# EAGLE design firecam (EAGLE 7.7.0)

## Sheet 1 of 4
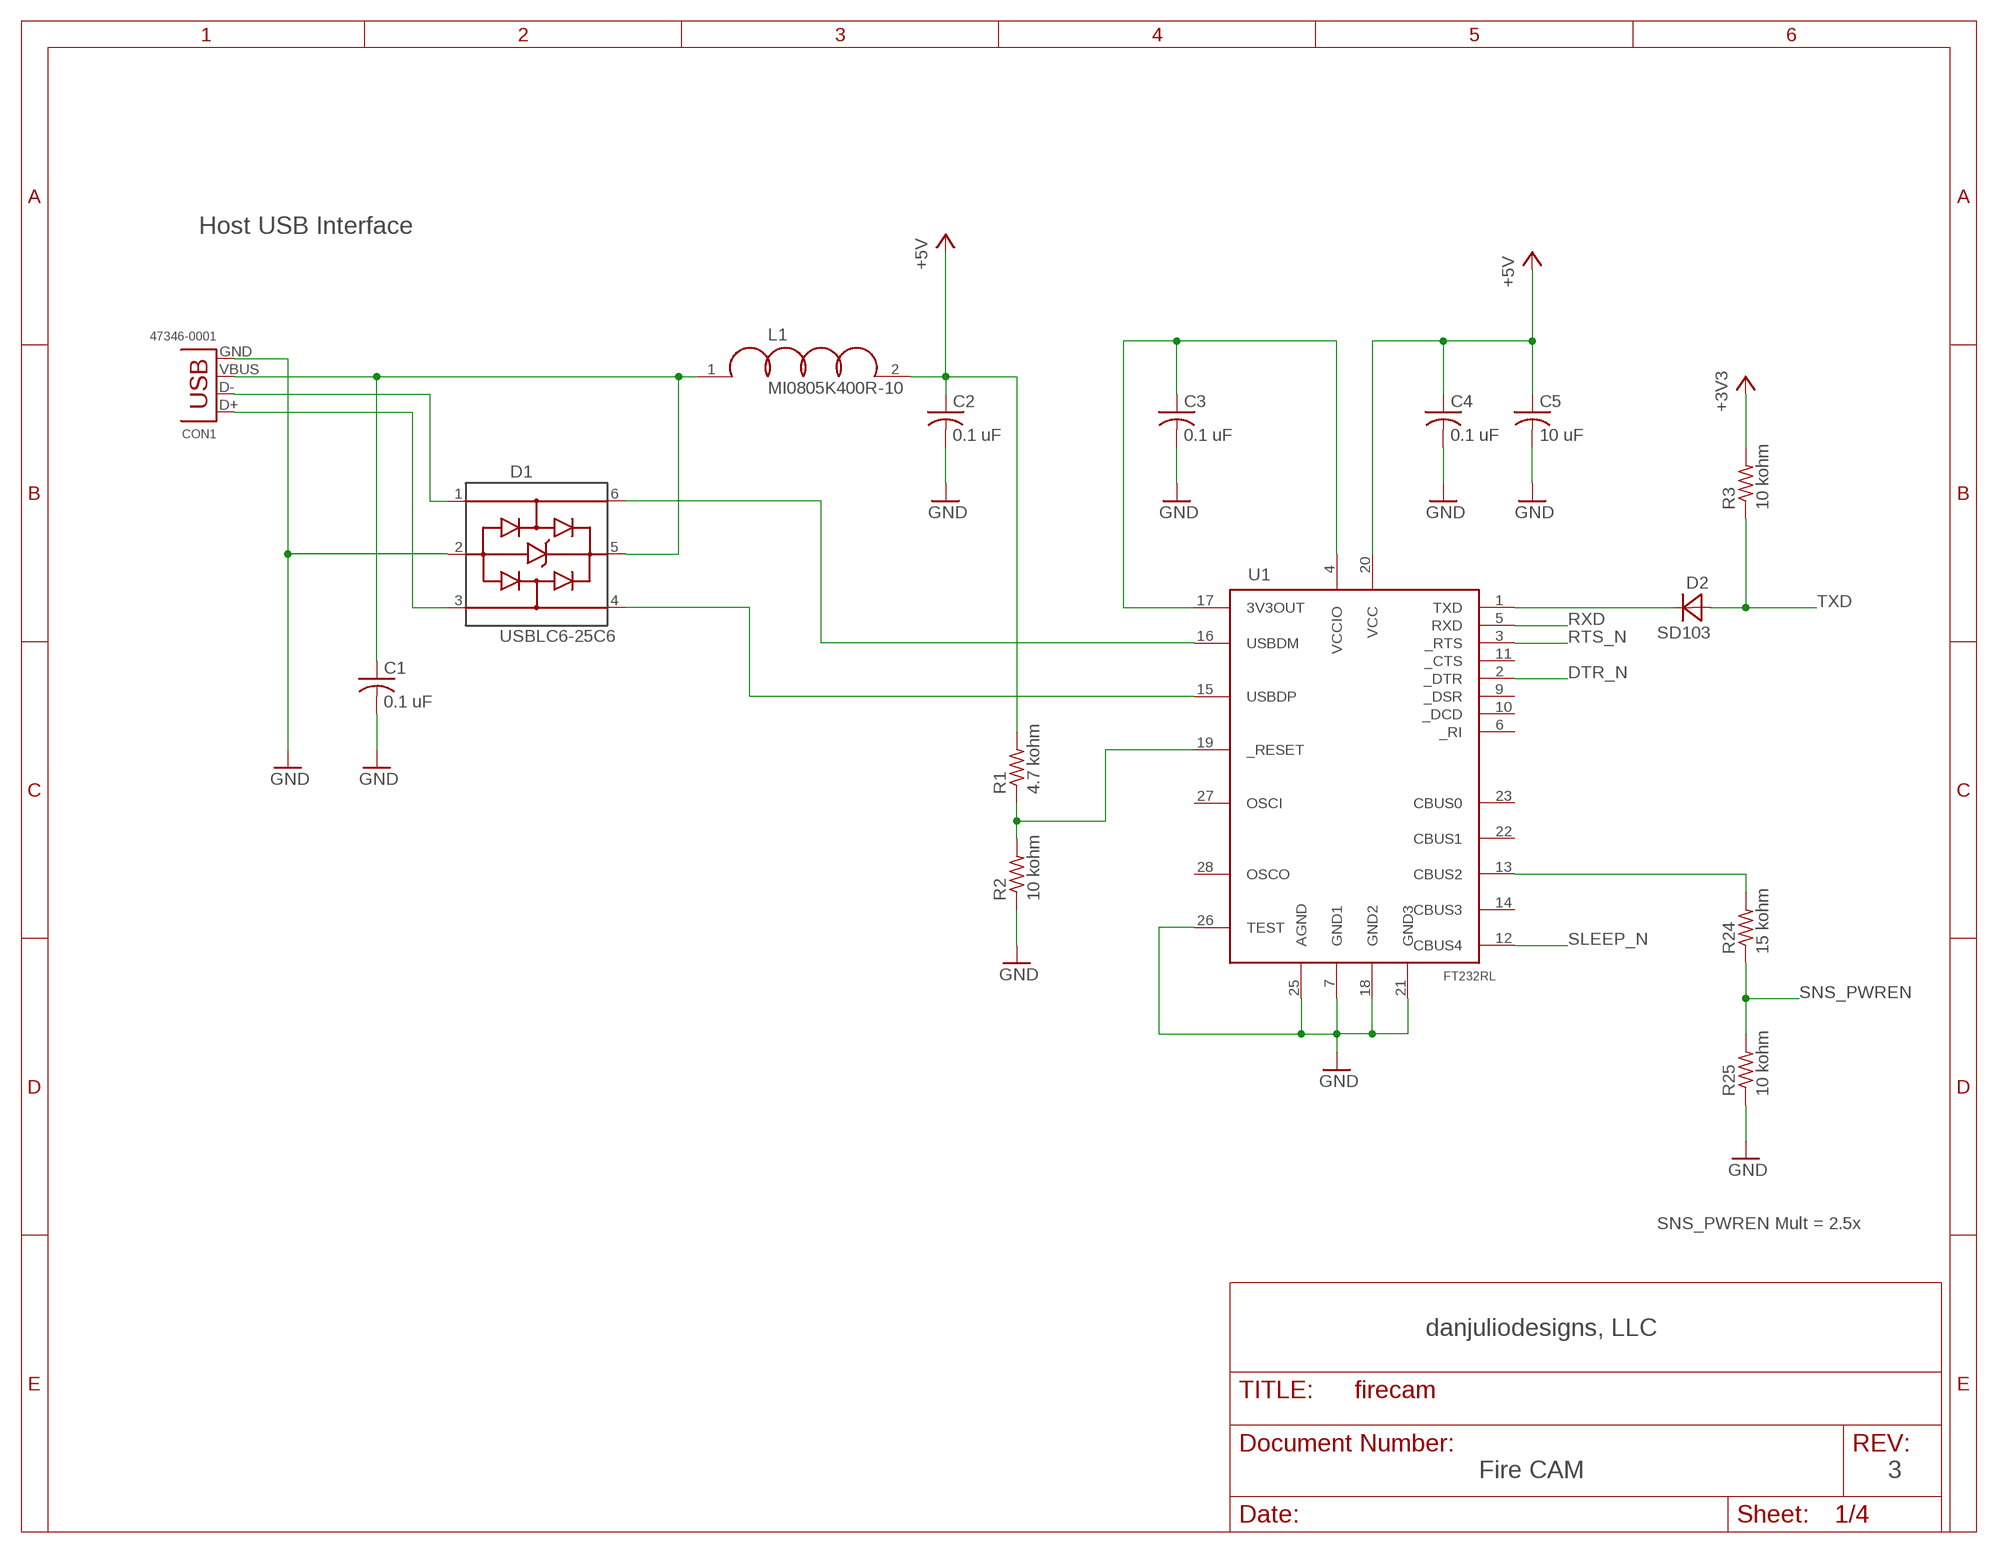
[diagram p0: schematic, sheet 1]

### Parts
C1  0.1 uF  C-USSMT0603  [C0603]
C2  0.1 uF  C-USSMT0603  [C0603]
C3  0.1 uF  C-USSMT0603  [C0603]
C4  0.1 uF  C-USSMT0603  [C0603]
C5  10 uF  C-USSMT0603  [C0603]
CON1  47346-0001  USBMICROB  [USB_MICROB_SMT]
D1  USBLC6-25C6  USBLC6-2SOT23-6  [SOT23-6]
D2  SD103  DIODESMT_SOD123  [SOD123]
L1  MI0805K400R-10  INDUCTORSMT0805  [L0805]
R1  4.7 kohm  R-USSMT0603  [R0603]
R2  10 kohm  R-USSMT0603  [R0603]
R3  10 kohm  R-USSMT0603  [R0603]
R24  15 kohm  R-USSMT0603  [R0603]
R25  10 kohm  R-USSMT0603  [R0603]
U1  FT232RL  FT232RLSSOP28  [SSOP28DB]

### Nets
+3V3: R3.2 ; also sheet 2,3,4
+5V: C2.1 C4.1 C5.1 L1.2 R1.2 U1.20(VCC) ; also sheet 2
DTR_N: U1.2(_DTR) ; also sheet 3
GND: C1.2 C2.2 C3.2 C4.2 C5.2 CON1.GND D1.2(GND) R2.1 R25.1 U1.7(GND1) U1.18(GND2) U1.21(GND3) U1.25(AGND) U1.26(TEST) ; also sheet 2,3,4
N$1: C1.1 CON1.VBUS D1.5(VBUS) L1.1
N$2: CON1.D+ D1.3(IO2)
N$3: CON1.D- D1.1(IO1)
N$4: C3.1 U1.4(VCCIO) U1.17(3V3OUT)
N$5: D2.C U1.1(TXD)
N$6: D1.6(IO1$1) U1.16(USBDM)
N$7: D1.4(IO2$1) U1.15(USBDP)
N$12: R1.1 R2.2 U1.19(_RESET)
N$25: R24.2 U1.13(CBUS2)
RTS_N: U1.3(_RTS) ; also sheet 3
RXD: U1.5(RXD) ; also sheet 3
SLEEP_N: U1.12(CBUS4) ; also sheet 2
SNS_PWREN: R24.1 R25.2 ; also sheet 3
TXD: D2.A R3.1 ; also sheet 3
Unconnected: U1.6(_RI) U1.9(_DSR) U1.10(_DCD) U1.11(_CTS) U1.14(CBUS3) U1.22(CBUS1) U1.23(CBUS0) U1.27(OSCI) U1.28(OSCO)

### Notes on the sheet
- Host USB Interface
- SNS_PWREN Mult = 2.5x
- danjuliodesigns, LLC
- Fire CAM | 3

## Sheet 2 of 4
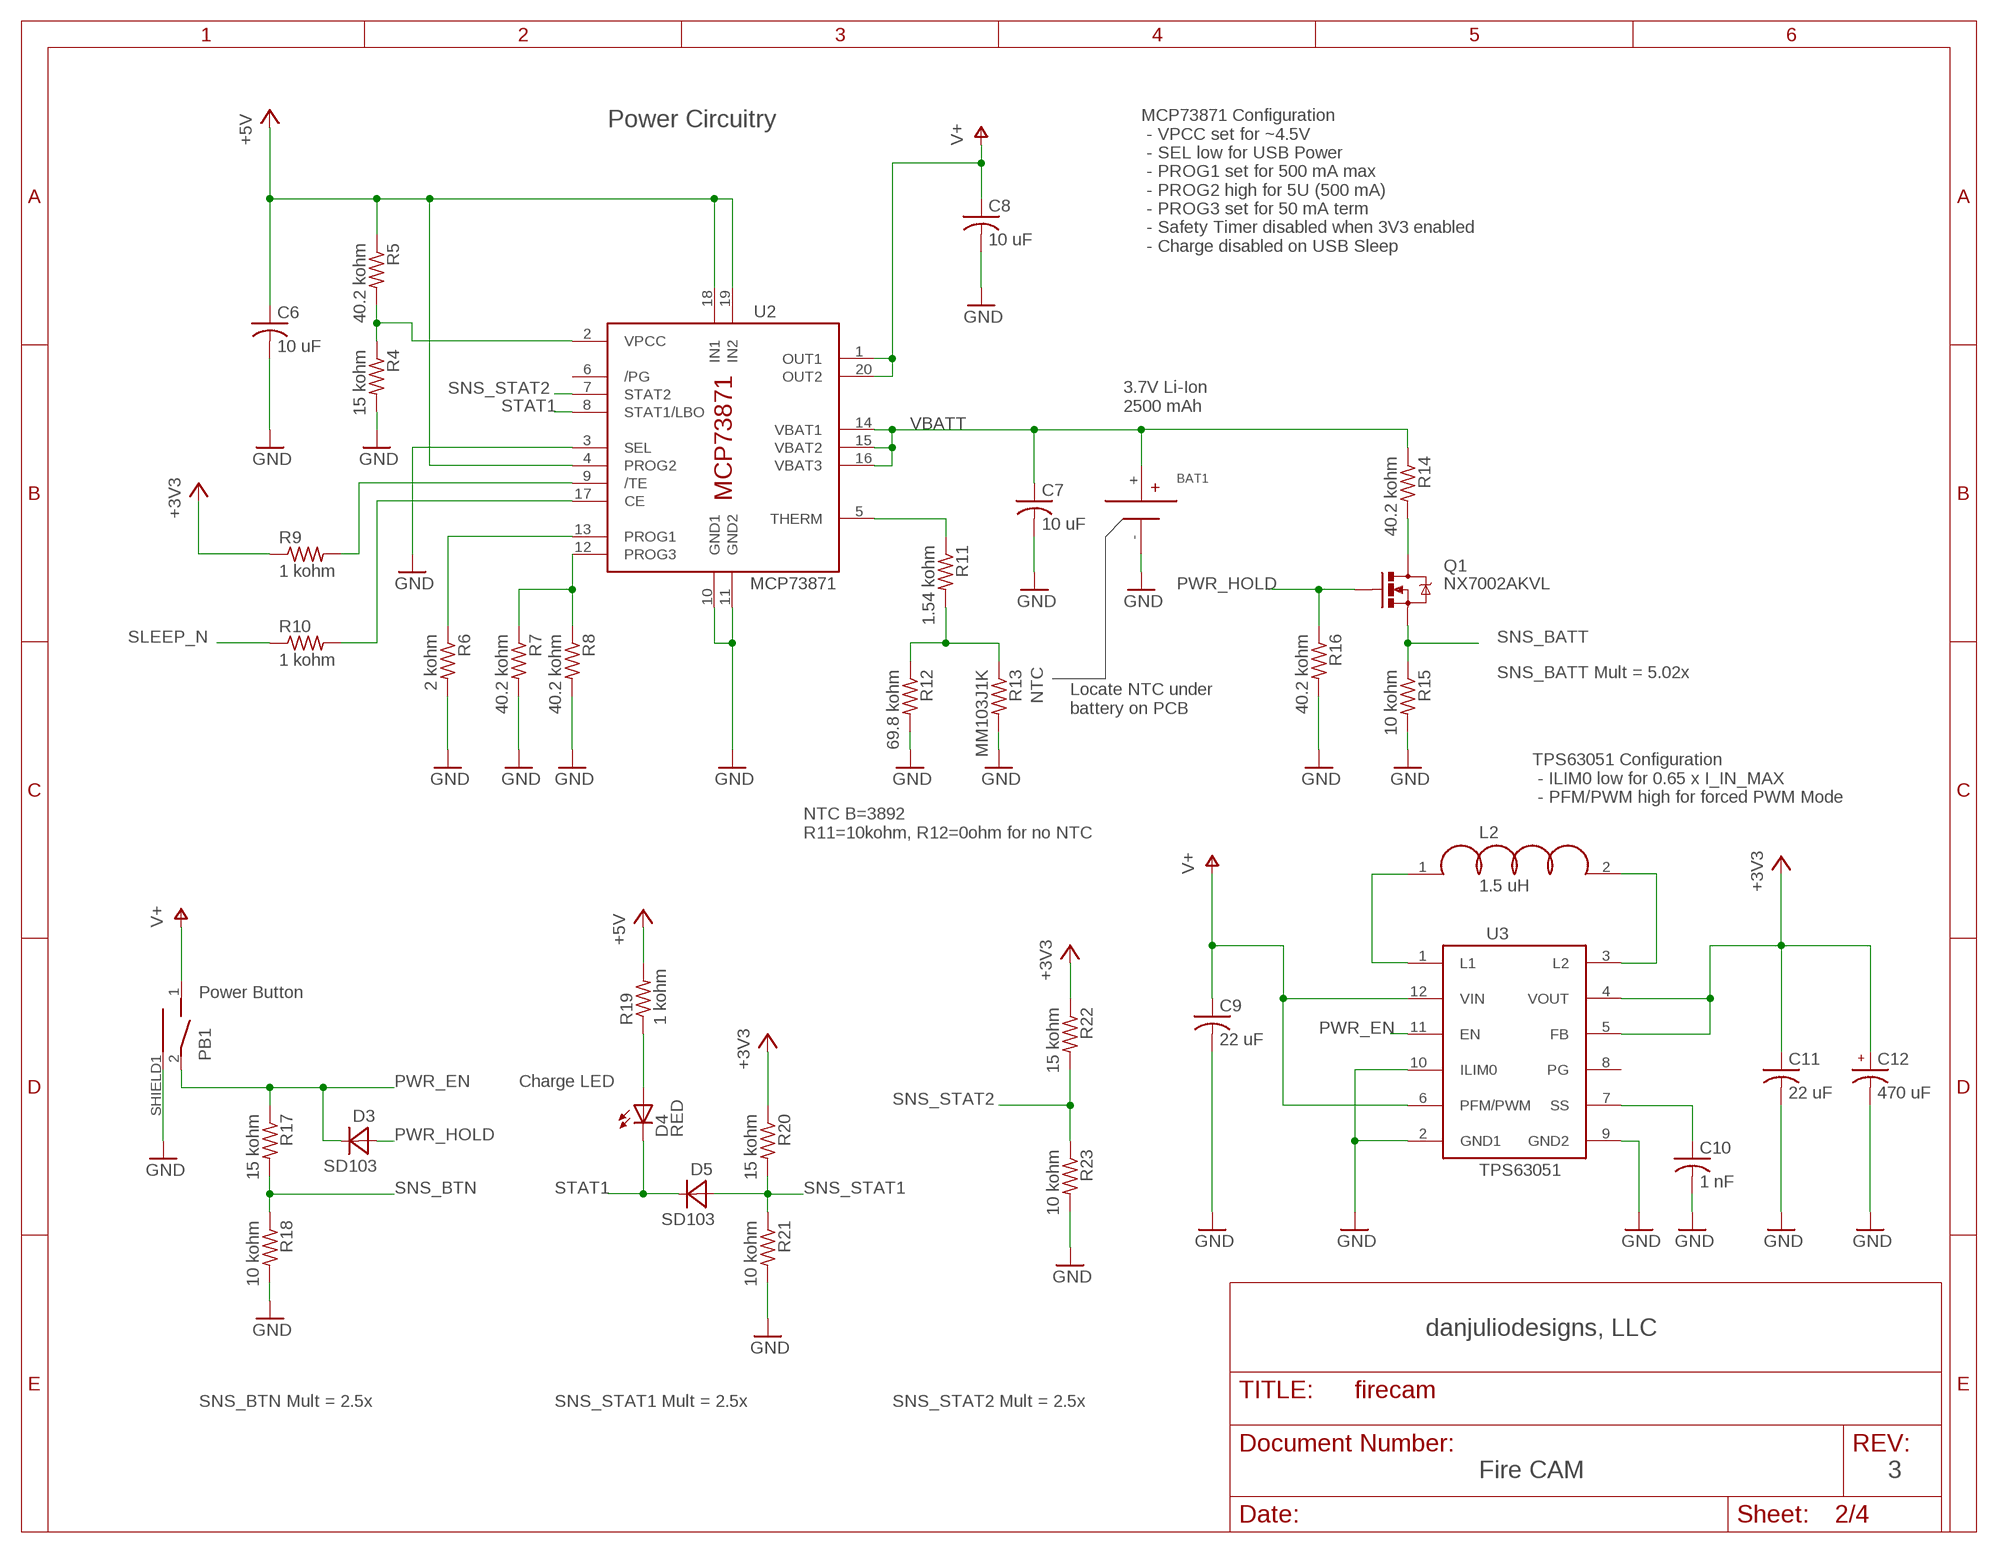
[diagram p1: schematic, sheet 2]

### Parts
BAT1  18650_BATTERYTH  [KEYSTONE_1043]
C6  10 uF  C-USSMT0603  [C0603]
C7  10 uF  C-USSMT0603  [C0603]
C8  10 uF  C-USSMT0603  [C0603]
C9  22 uF  C-USSMT0603  [C0603]
C10  1 nF  C-USSMT0603  [C0603]
C11  22 uF  C-USSMT0603  [C0603]
C12  470 uF  CPOL-USSMT06X06  [ECAP-0606]
D3  SD103  DIODESMT_SOD123  [SOD123]
D4  RED  LEDLUMEX_SMT_3MM  [LUMEX_3MM_SMT]
D5  SD103  DIODESMT_SOD123  [SOD123]
L2  1.5 uH  INDUCTORSMT1008  [L1008]
PB1  PB_SMT_SIDEPTS645  [PTS645_SIDE_TH]
Q1  NX7002AKVL  MOSFET-NCHANNELSOT23  [SOT23-3]
R4  15 kohm  R-USSMT0603  [R0603]
R5  40.2 kohm  R-USSMT0603  [R0603]
R6  2 kohm  R-USSMT0603  [R0603]
R7  40.2 kohm  R-USSMT0603  [R0603]
R8  40.2 kohm  R-USSMT0603  [R0603]
R9  1 kohm  R-USSMT0603  [R0603]
R10  1 kohm  R-USSMT0603  [R0603]
R11  1.54 kohm  R-USSMT0603  [R0603]
R12  69.8 kohm  R-USSMT0603  [R0603]
R13  MM103J1K  R-USSMT0603  [R0603]
R14  40.2 kohm  R-USSMT0603  [R0603]
R15  10 kohm  R-USSMT0603  [R0603]
R16  40.2 kohm  R-USSMT0603  [R0603]
R17  15 kohm  R-USSMT0603  [R0603]
R18  10 kohm  R-USSMT0603  [R0603]
R19  1 kohm  R-USSMT0603  [R0603]
R20  15 kohm  R-USSMT0603  [R0603]
R21  10 kohm  R-USSMT0603  [R0603]
R22  15 kohm  R-USSMT0603  [R0603]
R23  10 kohm  R-USSMT0603  [R0603]
U2  MCP73871  [QFN20]
U3  TPS63051  TPS63051_QFN  [HOTROD_QFN12]

### Nets
+3V3: C11.1 C12.+ R9.1 R20.1 R22.1 U3.4(VOUT) U3.5(FB) ; also sheet 1,3,4
+5V: C6.1 R5.1 R19.2 U2.4(PROG2) U2.18(IN1) U2.19(IN2) ; also sheet 1
GND: BAT1.- C6.2 C7.2 C8.2 C9.2 C10.2 C11.2 C12.- PB1.SHIELD1(CASE) R4.2 R6.2 R7.2 R8.2 R12.2 R13.2 R15.2 R16.2 R18.2 R21.2 R23.2 U2.3(SEL) U2.10(GND1) U2.11(GND2) U3.2(GND1) U3.9(GND2) U3.10(ILIM0) ; also sheet 1,3,4
N$9: R4.1 R5.2 U2.2(VPCC)
N$10: R6.1 U2.13(PROG1)
N$15: R7.1 R8.1 U2.12(PROG3)
N$18: R9.2 U2.9(/TE)
N$19: R10.2 U2.17(CE)
N$20: R11.1 U2.5(THERM)
N$21: L2.1 U3.1(L1)
N$22: Q1.3(D) R14.2
N$23: D4.P$1(A) R19.1
N$28: R11.2 R12.1 R13.1
N$29: L2.2 U3.3(L2)
N$32: C10.1 U3.7(SS)
PWR_EN: D3.C PB1.2 R17.1 U3.11(EN) ; also sheet 4
PWR_HOLD: D3.A Q1.1(G) R16.1 ; also sheet 3,4
SLEEP_N: R10.1 ; also sheet 1
SNS_BATT: Q1.2(S) R15.1 ; also sheet 3
SNS_BTN: R17.2 R18.1 ; also sheet 3
SNS_STAT1: D5.A R20.2 R21.1 ; also sheet 3
SNS_STAT2: R22.2 R23.1 U2.7(STAT2) ; also sheet 3
STAT1: D4.P$2(C) D5.C U2.8(STAT1/LBO)
V+: C8.1 C9.1 PB1.1 U2.1(OUT1) U2.20(OUT2) U3.6(PFM/PWM) U3.12(VIN) ; also sheet 4
VBATT: BAT1.+ C7.1 R14.1 U2.14(VBAT1) U2.15(VBAT2) U2.16(VBAT3)
Unconnected: U2.6(/PG) U3.8(PG)

### Notes on the sheet
- Power Circuitry
- MCP73871 Configuration
   - VPCC set for ~4.5V
   - SEL low for USB Power
   - PROG1 set for 500 mA max
   - PROG2 high for 5U (500 mA)
   - PROG3 set for 50 mA term
   - Safety Timer disabled when 3V3 enabled
   - Charge disabled on USB Sleep
- 3.7V Li-Ion
  2500 mAh
- SNS_BATT Mult = 5.02x
- NTC
- Locate NTC under
  battery on PCB
- TPS63051 Configuration
   - ILIM0 low for 0.65 x I_IN_MAX
   - PFM/PWM high for forced PWM Mode
- NTC B=3892
  R11=10kohm, R12=0ohm for no NTC
- Power Button
- Charge LED
- danjuliodesigns, LLC
- SNS_BTN Mult = 2.5x | SNS_STAT1 Mult = 2.5x | SNS_STAT2 Mult = 2.5x
- Fire CAM | 3

## Sheet 3 of 4
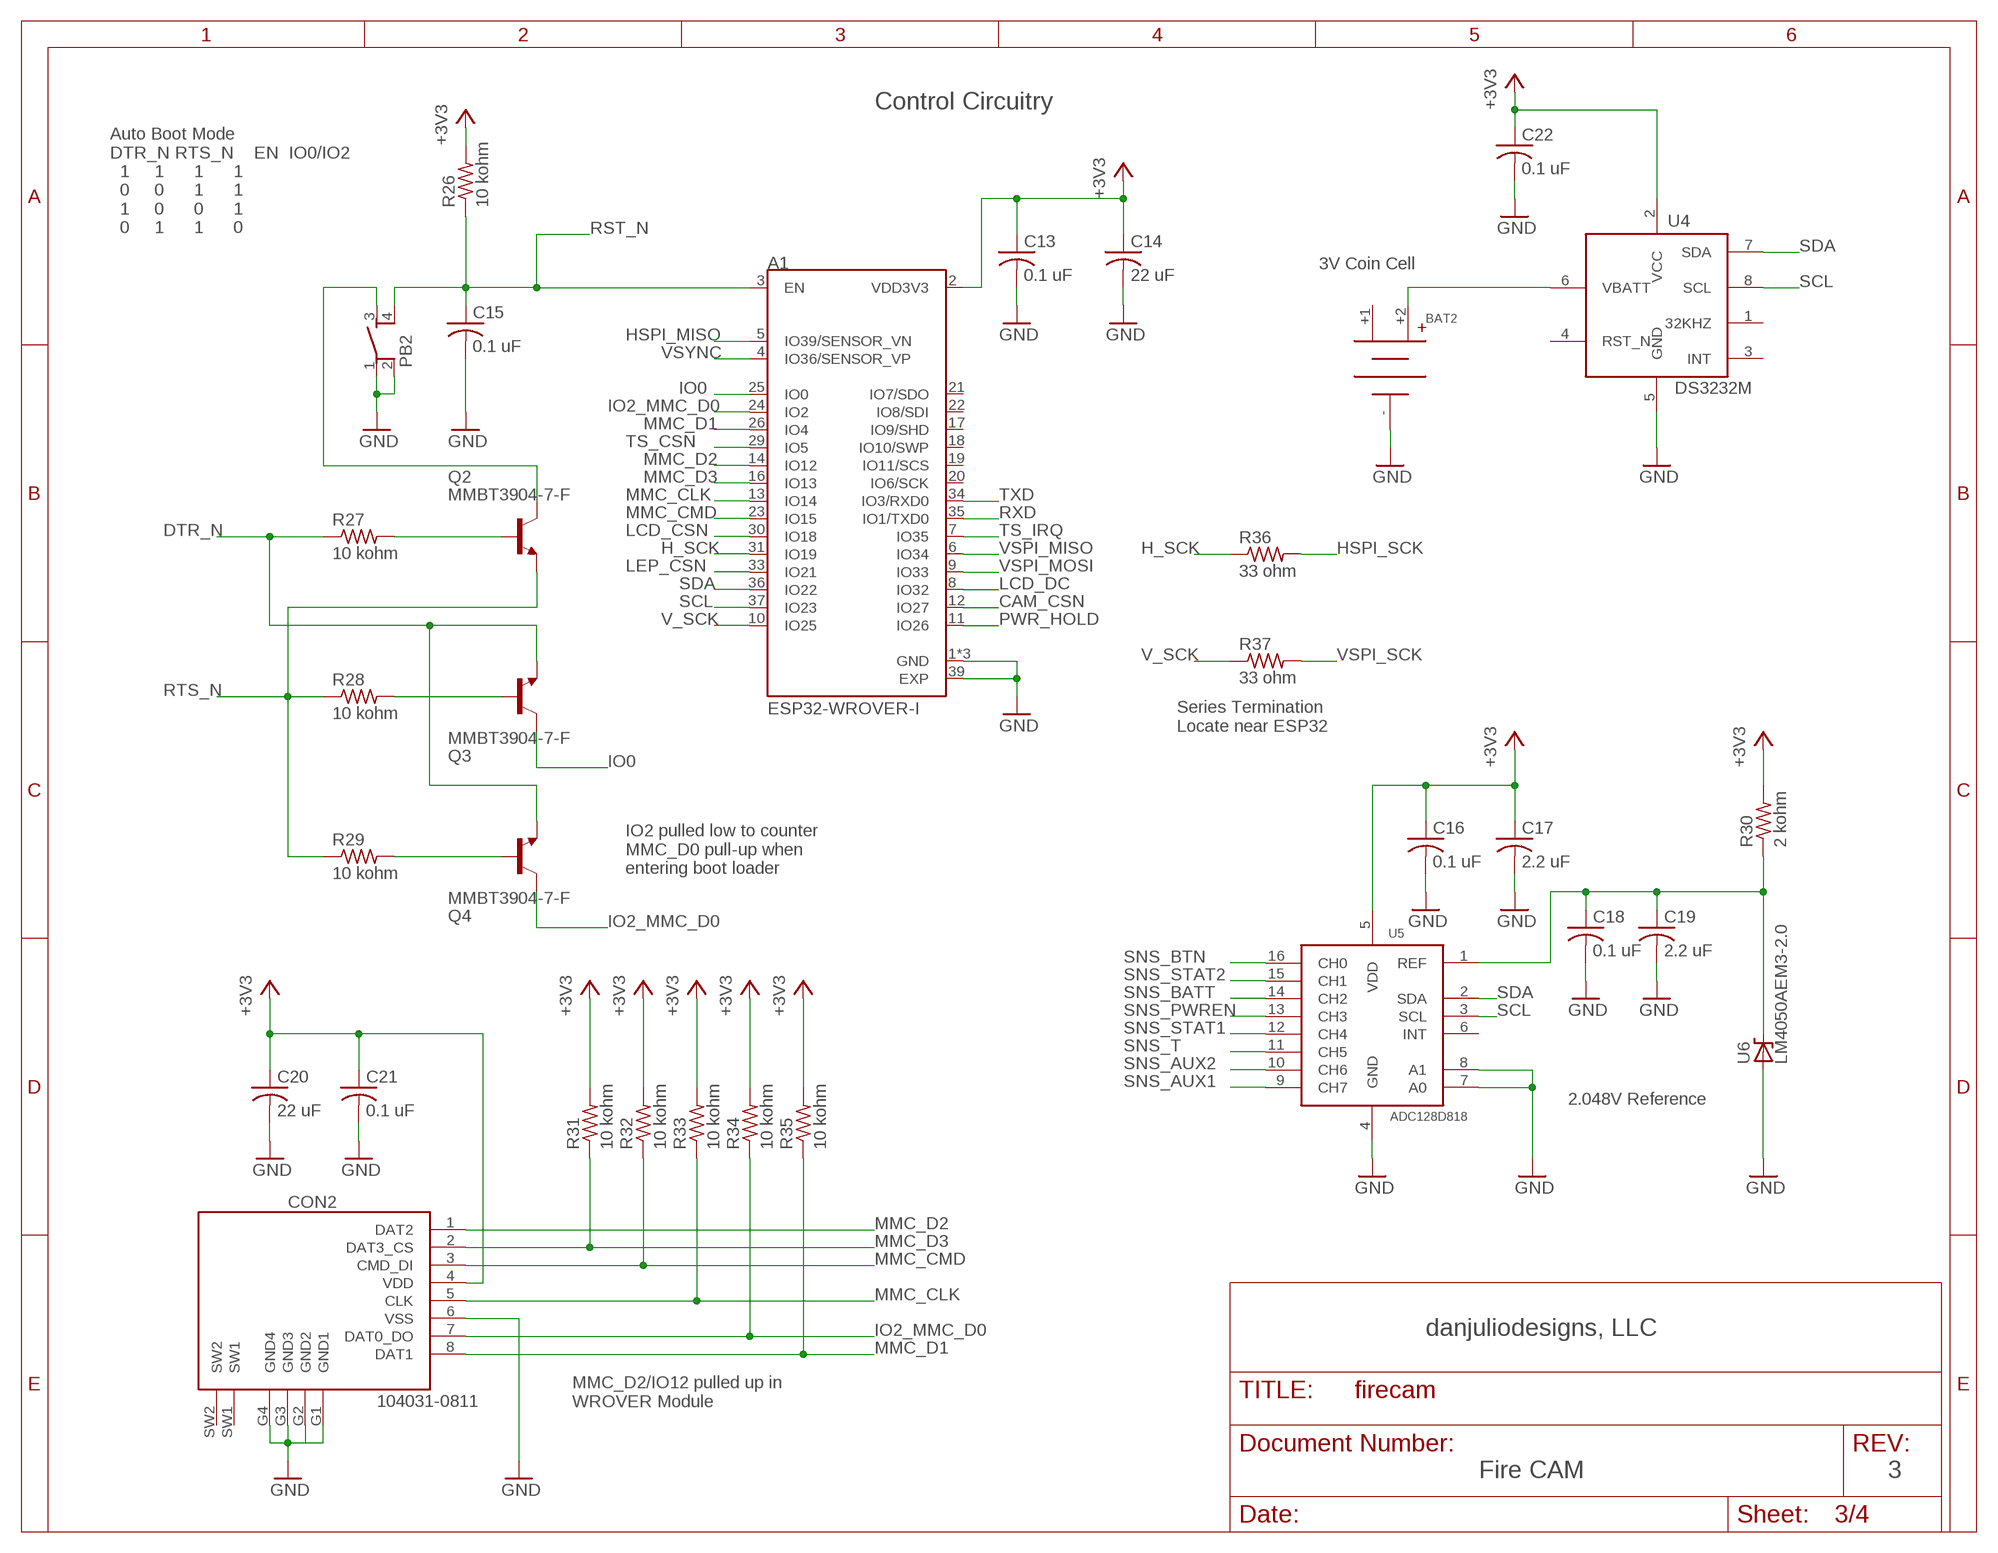
[diagram p2: schematic, sheet 3]

### Parts
A1  ESP32-WROVER-I  [XCVR_ESP32-WROVER-I]
BAT2  COIN_CELL12MM  [KEYSTONE_3001]
C13  0.1 uF  C-USSMT0603  [C0603]
C14  22 uF  C-USSMT0603  [C0603]
C15  0.1 uF  C-USSMT0603  [C0603]
C16  0.1 uF  C-USSMT0603  [C0603]
C17  2.2 uF  C-USSMT0603  [C0603]
C18  0.1 uF  C-USSMT0603  [C0603]
C19  2.2 uF  C-USSMT0603  [C0603]
C20  22 uF  C-USSMT0603  [C0603]
C21  0.1 uF  C-USSMT0603  [C0603]
C22  0.1 uF  C-USSMT0603  [C0603]
CON2  104031-0811  MOLEX_1040310811  [MOLEX_1040310811]
PB2  PB_TACT_4SMTR92  [CK_PTS645_SMT]
Q2  MMBT3904-7-F  BC808-NPN-SOT23-BEC  [SOT23-BEC]
Q3  MMBT3904-7-F  BC808-NPN-SOT23-BEC  [SOT23-BEC]
Q4  MMBT3904-7-F  BC808-NPN-SOT23-BEC  [SOT23-BEC]
R26  10 kohm  R-USSMT0603  [R0603]
R27  10 kohm  R-USSMT0603  [R0603]
R28  10 kohm  R-USSMT0603  [R0603]
R29  10 kohm  R-USSMT0603  [R0603]
R30  2 kohm  R-USSMT0603  [R0603]
R31  10 kohm  R-USSMT0603  [R0603]
R32  10 kohm  R-USSMT0603  [R0603]
R33  10 kohm  R-USSMT0603  [R0603]
R34  10 kohm  R-USSMT0603  [R0603]
R35  10 kohm  R-USSMT0603  [R0603]
R36  33 ohm  R-USSMT0603  [R0603]
R37  33 ohm  R-USSMT0603  [R0603]
U4  DS3232M  [SO8]
U5  ADC128D818  [SSOP16]
U6  LM4050AEM3-2.0  VOLTAGE_REFSMT_SOT23  [SOT23-3]

### Nets
+3V3: A1.2(VDD3V3) C13.1 C14.1 C16.1 C17.1 C20.1 C21.1 C22.1 CON2.4(VDD) R26.2 R30.2 R31.2 R32.2 R33.2 R34.2 R35.2 U4.2(VCC) U5.5(VDD) ; also sheet 1,2,4
CAM_CSN: A1.12(IO27) ; also sheet 4
DTR_N: Q3.E Q4.E R27.1 ; also sheet 1
GND: A1.1(GND) A1.15(GND) A1.38(GND) A1.39(EXP) BAT2.- C13.2 C14.2 C15.2 C16.2 C17.2 C18.2 C19.2 C20.2 C21.2 C22.2 CON2.6(VSS) CON2.G1(GND1) CON2.G2(GND2) CON2.G3(GND3) CON2.G4(GND4) PB2.1 PB2.2 U4.5(GND) U5.4(GND) U5.7(A0) U5.8(A1) U6.2(A) ; also sheet 1,2,4
H_SCK: A1.31(IO19) R36.1
HSPI_MISO: A1.5(IO39/SENSOR_VN) ; also sheet 4
HSPI_SCK: R36.2 ; also sheet 4
IO0: A1.25(IO0) Q3.C
IO2_MMC_D0: A1.24(IO2) CON2.7(DAT0_DO) Q4.C R34.1
LCD_CSN: A1.30(IO18) ; also sheet 4
LCD_DC: A1.8(IO32) ; also sheet 4
LEP_CSN: A1.33(IO21) ; also sheet 4
MMC_CLK: A1.13(IO14) CON2.5(CLK) R33.1
MMC_CMD: A1.23(IO15) CON2.3(CMD_DI) R32.1
MMC_D1: A1.26(IO4) CON2.8(DAT1) R35.1
MMC_D2: A1.14(IO12) CON2.1(DAT2)
MMC_D3: A1.16(IO13) CON2.2(DAT3_CS) R31.1
N$8: C18.1 C19.1 R30.1 U5.1(REF) U6.1(C)
N$13: BAT2.+2 U4.6(VBATT)
N$14: PB2.3 Q2.C
N$24: Q2.B R27.2
N$26: Q3.B R28.2
N$27: Q4.B R29.2
PWR_HOLD: A1.11(IO26) ; also sheet 2,4
RST_N: A1.3(EN) C15.1 PB2.4 R26.1 ; also sheet 4
RTS_N: Q2.E R28.1 R29.1 ; also sheet 1
RXD: A1.35(IO1/TXD0) ; also sheet 1
SCL: A1.37(IO23) U4.8(SCL) U5.3(SCL) ; also sheet 4
SDA: A1.36(IO22) U4.7(SDA) U5.2(SDA) ; also sheet 4
SNS_AUX1: U5.9(CH7) ; also sheet 4
SNS_AUX2: U5.10(CH6) ; also sheet 4
SNS_BATT: U5.14(CH2) ; also sheet 2
SNS_BTN: U5.16(CH0) ; also sheet 2
SNS_PWREN: U5.13(CH3) ; also sheet 1
SNS_STAT1: U5.12(CH4) ; also sheet 2
SNS_STAT2: U5.15(CH1) ; also sheet 2
SNS_T: U5.11(CH5) ; also sheet 4
TS_CSN: A1.29(IO5) ; also sheet 4
TS_IRQ: A1.7(IO35) ; also sheet 4
TXD: A1.34(IO3/RXD0) ; also sheet 1
V_SCK: A1.10(IO25) R37.1
VSPI_MISO: A1.6(IO34) ; also sheet 4
VSPI_MOSI: A1.9(IO33) ; also sheet 4
VSPI_SCK: R37.2 ; also sheet 4
VSYNC: A1.4(IO36/SENSOR_VP) ; also sheet 4
Unconnected: A1.17(IO9/SHD) A1.18(IO10/SWP) A1.19(IO11/SCS) A1.20(IO6/SCK) A1.21(IO7/SDO) A1.22(IO8/SDI) CON2.SW1 CON2.SW2 U4.1(32KHZ) U4.3(INT) U4.4(RST_N) U5.6(INT)

### Notes on the sheet
- Control Circuitry
- Auto Boot Mode
  DTR_N RTS_N    EN  IO0/IO2
    1     1      1      1
    0     0      1      1
    1     0      0      1
    0     1      1      0
- 3V Coin Cell
- Series Termination
  Locate near ESP32
- IO2 pulled low to counter
  MMC_D0 pull-up when 
  entering boot loader
- 2.048V Reference
- danjuliodesigns, LLC
- MMC_D2/IO12 pulled up in
  WROVER Module
- Fire CAM | 3

## Sheet 4 of 4
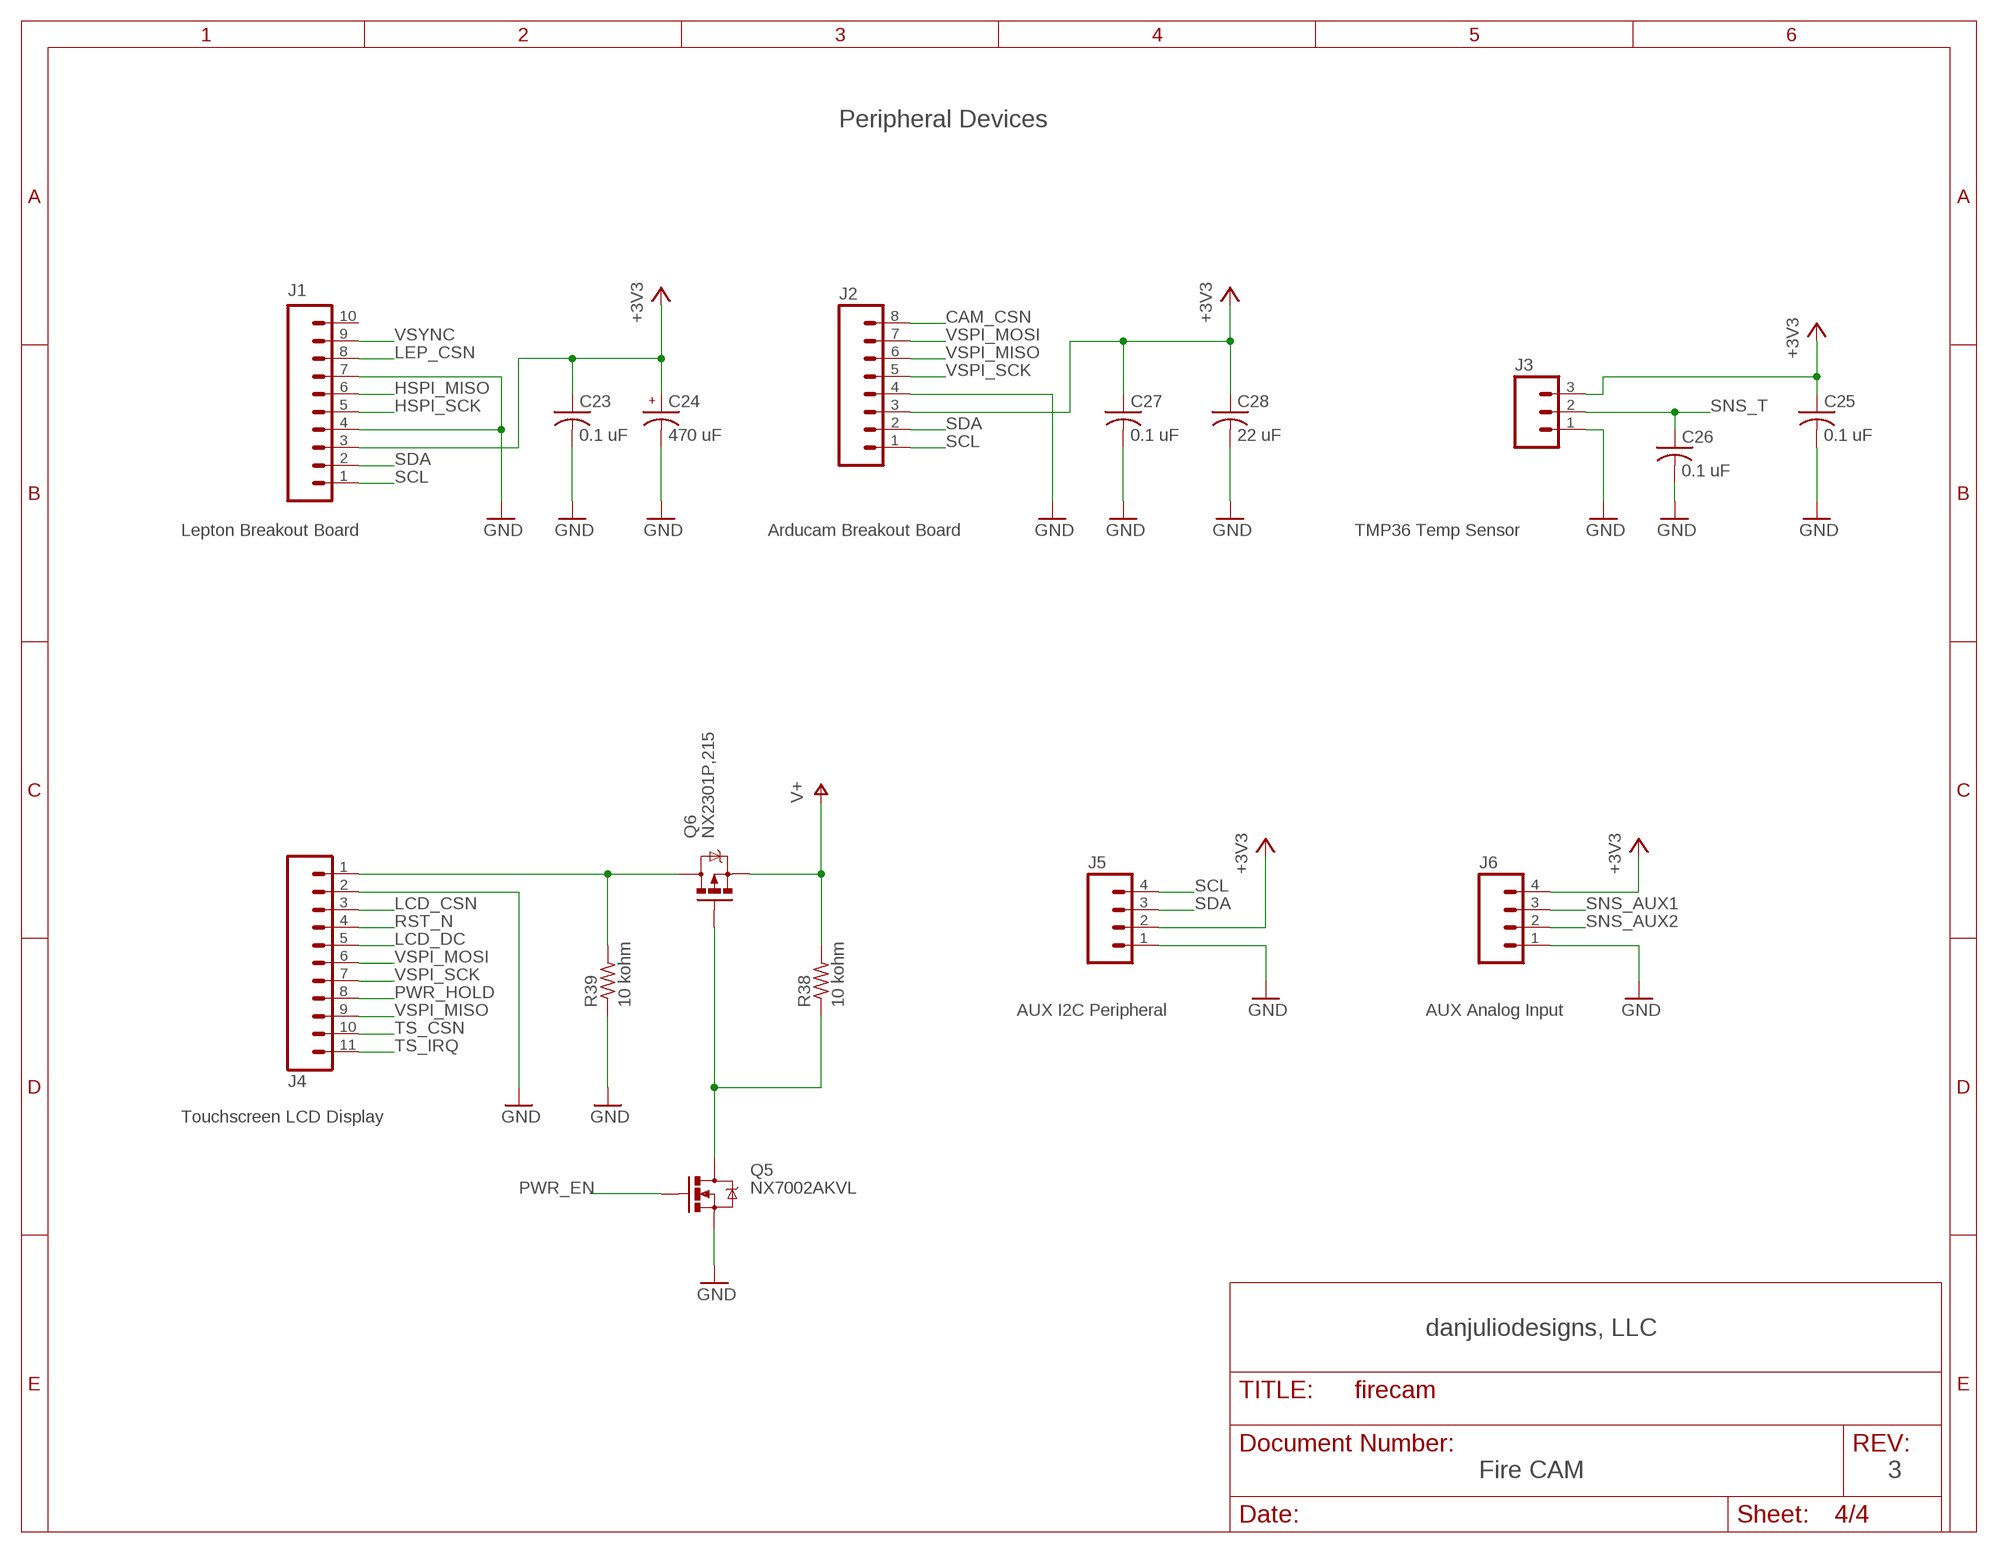
[diagram p3: schematic, sheet 4]

### Parts
C23  0.1 uF  C-USSMT0603  [C0603]
C24  470 uF  CPOL-USSMT06X06  [ECAP-0606]
C25  0.1 uF  C-USSMT0603  [C0603]
C26  0.1 uF  C-USSMT0603  [C0603]
C27  0.1 uF  C-USSMT0603  [C0603]
C28  22 uF  C-USSMT0603  [C0603]
J1  M10SILK_FEMALE_PTH  [1X10]
J2  M08SILK_FEMALE_PTH  [1X08]
J3  M03PTH  [1X03]
J4  M11PTH  [1X11]
J5  M04PTH  [1X04]
J6  M04PTH  [1X04]
Q5  NX7002AKVL  MOSFET-NCHANNELSOT23  [SOT23-3]
Q6  NX2301P,215  MOSFET-PCHANNEL  [SOT23-3]
R38  10 kohm  R-USSMT0603  [R0603]
R39  10 kohm  R-USSMT0603  [R0603]

### Nets
+3V3: C23.1 C24.+ C25.1 C27.1 C28.1 J1.3 J2.3 J3.3 J5.2 J6.4 ; also sheet 1,2,3
CAM_CSN: J2.8 ; also sheet 3
GND: C23.2 C24.- C25.2 C26.2 C27.2 C28.2 J1.4 J1.7 J2.4 J3.1 J4.2 J5.1 J6.1 Q5.2(S) R39.1 ; also sheet 1,2,3
HSPI_MISO: J1.6 ; also sheet 3
HSPI_SCK: J1.5 ; also sheet 3
LCD_CSN: J4.3 ; also sheet 3
LCD_DC: J4.5 ; also sheet 3
LEP_CSN: J1.8 ; also sheet 3
N$11: J4.1 Q6.3(D) R39.2
N$17: Q5.3(D) Q6.1(G) R38.1
PWR_EN: Q5.1(G) ; also sheet 2
PWR_HOLD: J4.8 ; also sheet 2,3
RST_N: J4.4 ; also sheet 3
SCL: J1.1 J2.1 J5.4 ; also sheet 3
SDA: J1.2 J2.2 J5.3 ; also sheet 3
SNS_AUX1: J6.3 ; also sheet 3
SNS_AUX2: J6.2 ; also sheet 3
SNS_T: C26.1 J3.2 ; also sheet 3
TS_CSN: J4.10 ; also sheet 3
TS_IRQ: J4.11 ; also sheet 3
V+: Q6.2(S) R38.2 ; also sheet 2
VSPI_MISO: J2.6 J4.9 ; also sheet 3
VSPI_MOSI: J2.7 J4.6 ; also sheet 3
VSPI_SCK: J2.5 J4.7 ; also sheet 3
VSYNC: J1.9 ; also sheet 3
Unconnected: J1.10

### Notes on the sheet
- Peripheral Devices
- Lepton Breakout Board | Arducam Breakout Board | TMP36 Temp Sensor
- AUX I2C Peripheral | AUX Analog Input
- Touchscreen LCD Display
- danjuliodesigns, LLC
- Fire CAM | 3

## Power pins joined to a net without a drawn wire
+1: BAT2.+1

## Library data of the parts
A1 = ESP32-WROVER-I:ESP32-WROVER-I: Module: combo; GPIO, I2C x2, I2S x2, SDIO, SPI x3, UART x3; U.FL; AVAILABILITY: Unavailable; DESCRIPTION: Module: combo; GPIO, I2C x2, I2S x2, SDIO, SPI x3, UART x3; U.FL; MF: Espressif Systems; MP: ESP32-WROVER-I; PACKAGE: Module Espressif Systems; PRICE: None
BAT1 = djd_eagle_library:18650_BATTERY: 18650 Battery Holder
BAT2 = djd_eagle_library:COIN_CELL
C1-C11 C13-C23 C25-C28 = djd_eagle_library:C-US
C12 C24 = djd_eagle_library:CPOL-US
CON1 = djd_eagle_library:USB
CON2 = djd_eagle_library:MOLEX_1040310811: Molex 104031-0811 Micro-SD socket
D1 = djd_eagle_library:USBLC6-2
D2 D3 D5 = djd_eagle_library:DIODE
D4 = djd_eagle_library:LED
J1 = SparkFun-Connectors:M10: Header 10 Standard 10-pin 0.1" header. Use with straight break away headers (SKU : PRT-00116), right angle break away headers (PRT-00553), swiss pins (PRT-00743), machine pins (PRT-00117), and female headers (PRT-00115).; PROD_ID: CONN-11563
J2 = SparkFun-Connectors:M08: Header 8 Standard 8-pin 0.1" header. Use with straight break away headers (SKU : PRT-00116), right angle break away headers (PRT-00553), swiss pins (PRT-00743), machine pins (PRT-00117), and female headers (PRT-00115).; PROD_ID: CONN-08438
J3 = SparkFun-Connectors:M03: Header 3 Standard 3-pin 0.1" header. Use with straight break away headers (SKU : PRT-00116), right angle break away headers (PRT-00553), swiss pins (PRT-00743), machine pins (PRT-00117), and female headers (PRT-00115). Molex polarized connector foot print use with SKU : PRT-08232 with associated crimp pins and housings.
J4 = SparkFun-Connectors:M11: Header 11 Standard 11-pin 0.1" header. Use with straight break away headers (SKU : PRT-00116), right angle break away headers (PRT-00553), swiss pins (PRT-00743), machine pins (PRT-00117), and female headers (PRT-00115).
J5 J6 = SparkFun-Connectors:M04: Header 4 Standard 4-pin 0.1" header. Use with straight break away headers (SKU : PRT-00116), right angle break away headers (PRT-00553), swiss pins (PRT-00743), machine pins (PRT-00117), and female headers (PRT-00115). Molex polarized connector foot print use with SKU : PRT-08231 with associated crimp pins and housings. 1MM SMD Version SKU: PRT-10208; PROD_ID: CONN-09696
L1 L2 = djd_eagle_library:INDUCTOR
PB1 = djd_eagle_library:PB_SMT_SIDE
PB2 = djd_eagle_library:PB_TACT_4: Common 4-pin Tact Button
Q1 Q5 = djd_eagle_library:MOSFET-NCHANNEL
Q2-Q4 = transistor:*-NPN-: NPN Transistror BF959 corrected 2008.03.06
Q6 = djd_eagle_library:MOSFET-PCHANNEL
R1-R39 = djd_eagle_library:R-US
U1 = djd_eagle_library:FT232RL: USB UART FTDI FT232R USB interface
U2 = adafruit:MCP73871
U3 = djd_eagle_library:TPS63051_QFN: TI TPS63051 1A Boost-Buck converter (QFN)
U4 = djd_eagle_library:DS3232M: Dallas +/- 5 ppm RTC with SRAM
U5 = djd_eagle_library:ADC128D818: TI ADC128D818 8-channel 12-bit I2C ADC
U6 = djd_eagle_library:VOLTAGE_REF

## Board
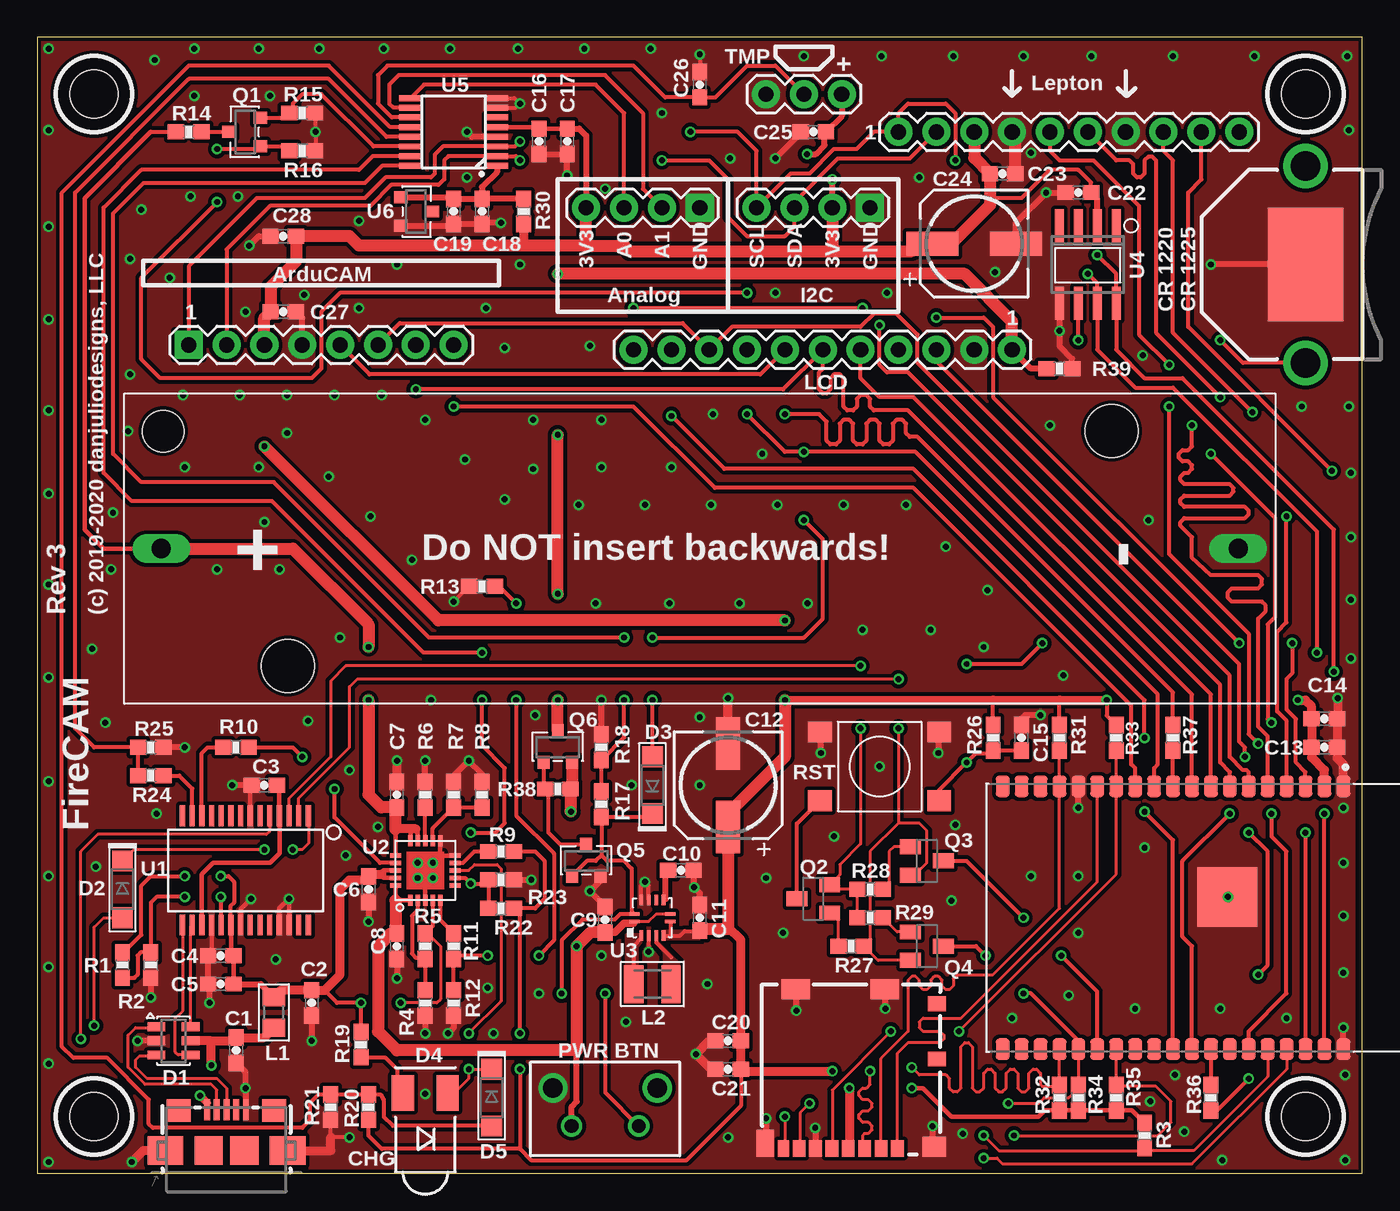
[diagram p4: board, top side]
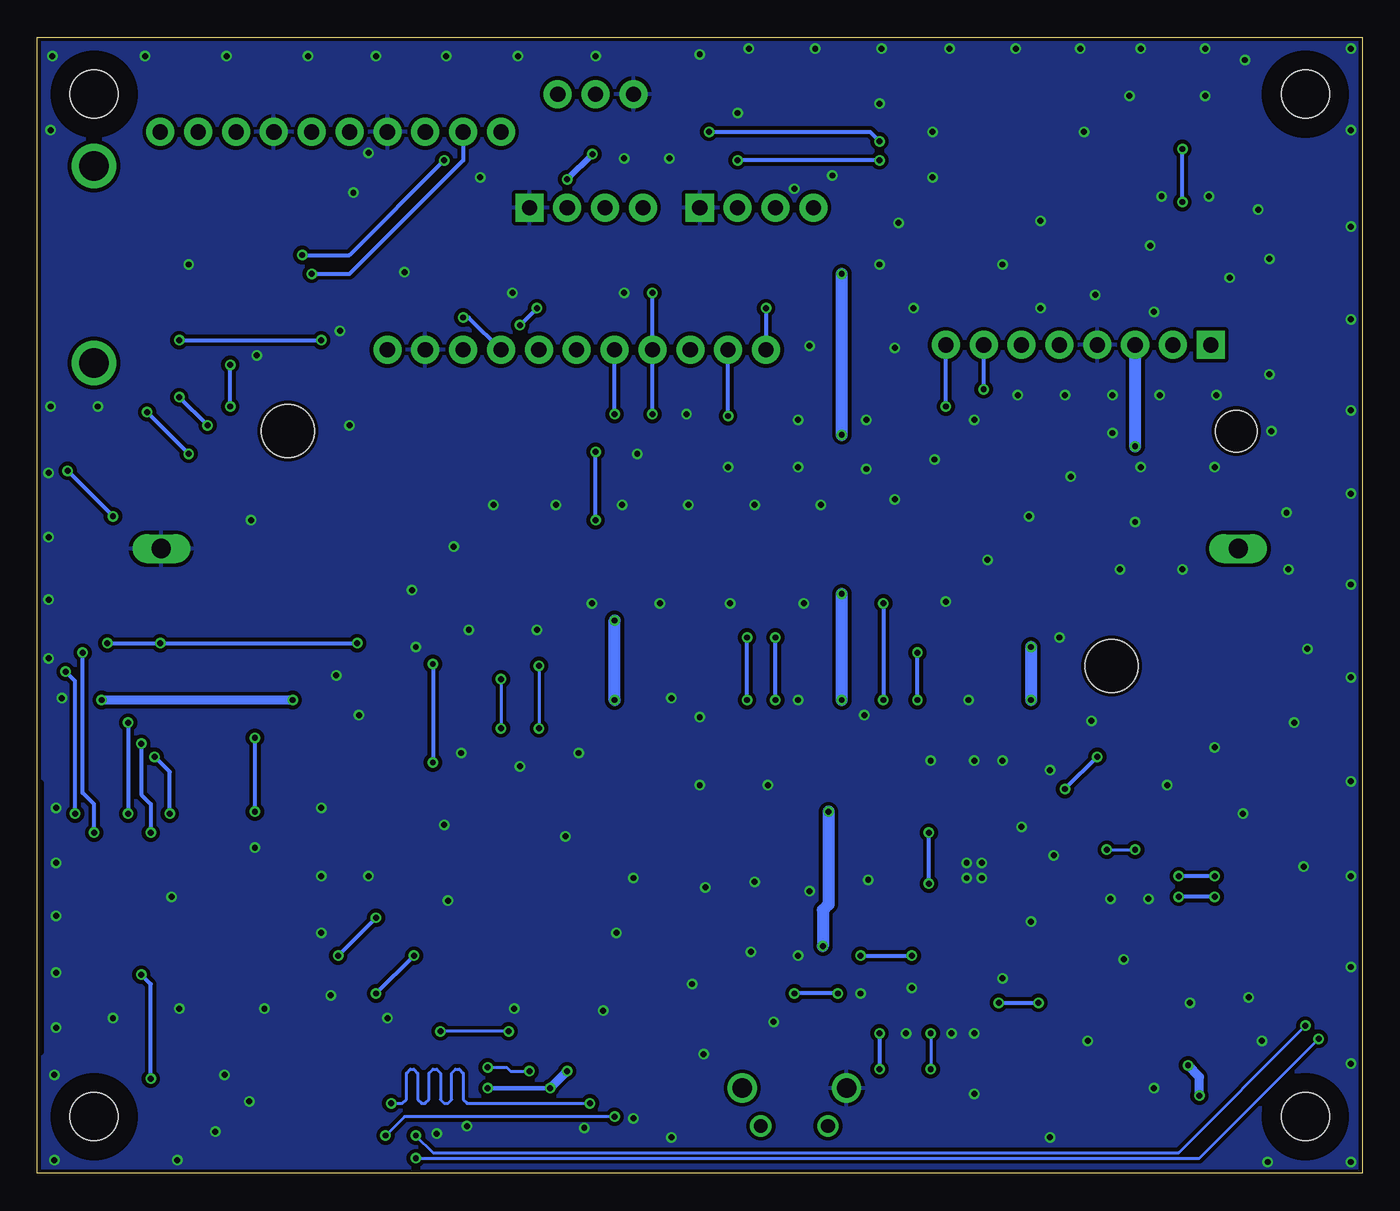
[diagram p5: board, bottom side, seen from below]

Size 88.9 x 76.2 mm. Coordinates in mm from the lower left corner, seen from the top.
Outline: 0,0 88.9,0 88.9,76.2 0,76.2 0,0
Copper layers (1*16): Top 0.035mm / dielectric 1.5mm / Bottom 0.035mm
Design rules "ITead_rule": minimum track width 6mil, minimum drill 12mil, track to track 6mil, track to pad 6mil, pad to pad 6mil, via to via 6mil, smd to smd 0mil, copper to edge 10mil, drill to drill 10mil, minimum pad ring 10mil, minimum via ring 6mil, stop-mask expansion 2mil, vias tented up to drill 100mil, thermal gap 10mil
Holes 3.2 mm at 3.81,3.81 85.09,3.81 3.81,72.39 85.09,72.39
tRestrict: area 1.3,1.3 to 6.3,6.3; area 82.5,1.3 to 87.6,6.3; area 82.5,69.8 to 87.6,74.9; area 1.3,69.8 to 6.3,74.9
bRestrict: area 82.5,1.3 to 87.6,6.3; area 1.3,1.3 to 6.3,6.3; area 1.3,69.8 to 6.3,74.9; area 82.5,69.8 to 87.6,74.9

### Footprints (pad centres in the part's own frame; a part is rotated, then mirrored left to right if it is on the bottom)
XCVR_ESP32-WROVER-I = smd 1.45 x 0.93: 1 -8.81,8.26; 2 -8.81,6.99; 3 -8.81,5.72; 4 -8.81,4.45; 5 -8.81,3.18; 6 -8.81,1.91; 7 -8.81,0.64; 8 -8.81,-0.63; 9 -8.81,-1.9; 10 -8.81,-3.17; 11 -8.81,-4.44; 12 -8.81,-5.71; 13 -8.81,-6.98; 14 -8.81,-8.25; 15 -8.81,-9.52; 16 -8.81,-10.79; 17 -8.81,-12.06; 18 -8.81,-13.33; 19 -8.81,-14.6; 20 8.81,-14.6; 21 8.81,-13.33; 22 8.81,-12.06; 23 8.81,-10.79; 24 8.81,-9.52; 25 8.81,-8.25; 26 8.81,-6.98; 27 8.81,-5.71; 28 8.81,-4.44; 29 8.81,-3.17; 30 8.81,-1.9; 31 8.81,-0.63; 32 8.81,0.64; 33 8.81,1.91; 34 8.81,3.18; 35 8.81,4.45; 36 8.81,5.72; 37 8.81,6.99; 38 8.81,8.26 | smd 4 x 4: 39 -1.38,0.47
KEYSTONE_1043 = drill 1.3 long: + 36.132,0; - -36.132,0 | hole 3.556: 27.622,7.874; -27.622,-7.874 | hole 2.8: 36.005,-7.874
KEYSTONE_3001 = drill 2: +1 -6.604,0; +2 6.604,0 | smd 7.62 x 5.08: - 0,0
C0603 = smd 1.1 x 1: 1 -0.85,0; 2 0.85,0
ECAP-0606 = smd 3.5 x 1.6: + 2.8,0; - -2.8,0
USB_MICROB_SMT = smd 1.4 x 0.4: D+ 2.75,0; D- 2.75,0.65; GND 2.75,-1.3; ID 2.75,-0.65; VBUS 2.75,1.3 | smd 1.9 x 2.4: SHIELD1 0,4.1; SHIELD4 0,-4.1 | smd 1.9 x 1.9: SHIELD2 0,1.2; SHIELD3 0,-1.2 | smd 1.5 x 1.6: SHIELD5 2.7,3.2; SHIELD6 2.7,-3.2
MOLEX_1040310811 = smd 0.85 x 1.1: 1 3.105,0.4; 2 2.005,0.4; 3 0.905,0.4; 4 -0.195,0.4; 5 -1.295,0.4; 6 -2.395,0.4; 7 -3.495,0.4 | smd 0.75 x 1.1: 8 -4.545,0.4 | smd 1.55 x 1.35: G1 5.565,0.525 | smd 1.17 x 1.8: G2 -5.755,0.75 | smd 1.9 x 1.35: G3 -3.73,11.075; G4 2.24,11.075 | smd 1.2 x 1: SW1 5.74,10.1; SW2 5.74,6.4
SOT23-6 = smd 0.6 x 1.2: 1 -0.95,-1.15; 2 0,-1.15; 3 0.95,-1.15; 4 0.95,1.15; 5 0,1.15; 6 -0.95,1.15
SOD123 = smd 1.4 x 1.4: A 1.9,0; C -1.9,0
LUMEX_3MM_SMT = smd 2.4 x 1.5: P$1 1.2,1.5; P$2 1.2,-1.5
1X10 = drill 1.016 pad 1.88: 1 0,0; 2 2.54,0; 3 5.08,0; 4 7.62,0; 5 10.16,0; 6 12.7,0; 7 15.24,0; 8 17.78,0; 9 20.32,0; 10 22.86,0
1X08 = drill 1.016 pad 1.88 square: 1 0,0 | drill 1.016 pad 1.88: 2 2.54,0; 3 5.08,0; 4 7.62,0; 5 10.16,0; 6 12.7,0; 7 15.24,0; 8 17.78,0
1X03 = drill 1.016 pad 1.88: 1 0,0; 2 2.54,0; 3 5.08,0
1X11 = drill 1.016 pad 1.88: 1 0,0; 2 2.54,0; 3 5.08,0; 4 7.62,0; 5 10.16,0; 6 12.7,0; 7 15.24,0; 8 17.78,0; 9 20.32,0; 10 22.86,0; 11 25.4,0
1X04 = drill 1.016 pad 1.88 square: 1 0,0 | drill 1.016 pad 1.88: 2 2.54,0; 3 5.08,0; 4 7.62,0
L0805 = smd 1.2 x 1.5: 1 -1.03,0; 2 1.03,0
L1008 = smd 1.3 x 2.55: 1 -1.25,0; 2 1.25,0
PTS645_SIDE_TH = drill 0.92: 1 -2.25,0; 2 2.25,0 | drill 1.3: SHIELD1 -3.5,2.55; SHIELD2 3.5,2.55
CK_PTS645_SMT = smd 1.6 x 1.4: 1 -4,2.3; 2 4,2.3; 3 -4,-2.3; 4 4,-2.3
SOT23-3 = smd 0.8 x 0.9: 1 -0.95,-1; 2 0.95,-1; 3 0,1.1
SOT23-BEC = smd 1 x 1.4: B -0.95,-1.1; C 0,1.1; E 0.95,-1.1
R0603 = smd 1.1 x 1: 1 -0.85,0; 2 0.85,0
SSOP28DB = smd 0.348 x 1.397: 1 -4.225,-3.656; 2 -3.575,-3.656; 3 -2.925,-3.656; 4 -2.275,-3.656; 5 -1.625,-3.656; 6 -0.975,-3.656; 7 -0.325,-3.656; 8 0.325,-3.656; 9 0.975,-3.656; 10 1.625,-3.656; 11 2.275,-3.656; 12 2.925,-3.656; 13 3.575,-3.656; 14 4.225,-3.656; 15 4.225,3.656; 16 3.575,3.656; 17 2.925,3.656; 18 2.275,3.656; 19 1.625,3.656; 20 0.975,3.656; 21 0.325,3.656; 22 -0.325,3.656; 23 -0.975,3.656; 24 -1.625,3.656; 25 -2.275,3.656; 26 -2.925,3.656; 27 -3.575,3.656; 28 -4.225,3.656
QFN20 = smd 0.75 x 0.3: 1 -2,1; 2 -2,0.5; 3 -2,0; 4 -2,-0.5; 5 -2,-1; 11 2,-1; 12 2,-0.5; 13 2,0; 14 2,0.5; 15 2,1 | smd 0.3 x 0.75: 6 -1,-2; 7 -0.5,-2; 8 0,-2; 9 0.5,-2; 10 1,-2; 16 1,2; 17 0.5,2; 18 0,2; 19 -0.5,2; 20 -1,2
HOTROD_QFN12 = smd 0.7 x 0.25: 1 -1.2,0.75; 2 -1.2,0.25; 3 -1.2,-0.25; 4 -1.2,-0.75; 7 1.2,-0.75; 8 1.2,-0.25; 9 1.2,0.25; 10 1.2,0.75 | smd 0.25 x 0.7: 5 -0.25,-1.2; 6 0.25,-1.2; 11 0.25,1.2; 12 -0.25,1.2
SO8 = smd 0.6 x 2.2: 1 -1.905,-2.6; 2 -0.635,-2.6; 3 0.635,-2.6; 4 1.905,-2.6; 5 1.905,2.6; 6 0.635,2.6; 7 -0.635,2.6; 8 -1.905,2.6
SSOP16 = smd 1.5 x 0.4: 1 -2.9,2.275; 2 -2.9,1.625; 3 -2.9,0.975; 4 -2.9,0.325; 5 -2.9,-0.325; 6 -2.9,-0.975; 7 -2.9,-1.625; 8 -2.9,-2.275; 9 2.9,-2.275; 10 2.9,-1.625; 11 2.9,-0.975; 12 2.9,-0.325; 13 2.9,0.325; 14 2.9,0.975; 15 2.9,1.625; 16 2.9,2.275

### Placement (x,y rotation side)
A1  79.38,17.14 270 top
BAT1  44.45,41.91 180 top
BAT2  85.09,60.96 270 top
C1  13.34,8.26 270 top
C2  18.41,11.43 270 top
C3  15.24,26.04 180 top
C4  12.32,14.61 180 top
C5  12.32,12.7 180 top
C6  22.23,19.05 270 top
C7  24.13,25.4 90 top
C8  24.13,15.24 270 top
C9  38.1,17.02 90 top
C10  43.18,20.32 0 top
C11  44.45,17.14 90 top
C12  46.35,26.04 270 top
C13  86.36,28.57 0 top
C14  86.36,30.48 0 top
C15  66.04,29.21 90 top
C16  33.66,69.22 270 top
C17  35.56,69.22 270 top
C18  29.84,64.52 270 top
C19  27.94,64.52 270 top
C20  46.35,8.89 180 top
C21  46.35,6.99 180 top
C22  69.85,65.79 180 top
C23  64.77,67.06 0 top
C24  62.87,62.36 180 top
C25  52.07,69.85 180 top
C26  44.45,73.03 90 top
C27  16.51,57.78 0 top
C28  16.51,62.87 180 top
CON1  12.7,1.52 90 top
CON2  54.61,1.27 0 top
D1  9.14,8.89 270 top
D2  5.71,19.05 270 top
D3  41.27,26.04 90 top
D4  26.04,4.19 90 top
D5  30.48,5.08 270 top
J1  57.78,69.85 0 top
J2  10.16,55.56 0 top
J3  48.9,72.39 0 top
J4  65.41,55.24 180 top
J5  55.88,64.77 180 top
J6  44.45,64.77 180 top
L1  15.88,10.79 90 top
L2  41.27,12.7 0 top
PB1  38.1,3.17 0 top
PB2  56.52,27.3 0 top
Q1  13.97,69.85 90 top
Q2  52.07,18.41 90 top
Q3  59.69,20.95 270 top
Q4  59.69,15.24 270 top
Q5  36.83,20.95 0 top
Q6  34.92,28.57 0 top
R1  5.71,13.97 90 top
R2  7.62,13.97 90 top
R3  74.3,2.54 90 top
R4  26.04,11.43 270 top
R5  26.04,15.24 270 top
R6  26.04,25.4 90 top
R7  27.94,25.4 90 top
R8  29.84,25.4 90 top
R9  31.11,21.59 180 top
R10  13.34,28.57 0 top
R11  27.94,15.24 270 top
R12  27.94,11.43 270 top
R13  29.84,39.37 180 top
R14  10.16,69.85 0 top
R15  17.78,71.12 0 top
R16  17.78,68.58 0 top
R17  37.85,24.77 90 top
R18  37.85,28.57 90 top
R19  21.72,8.64 90 top
R20  22.23,4.45 90 top
R21  19.68,4.45 270 top
R22  31.11,17.78 180 top
R23  31.11,19.68 0 top
R24  7.62,26.67 0 top
R25  7.62,28.57 180 top
R26  64.14,29.21 90 top
R27  54.61,15.24 180 top
R28  55.88,19.05 0 top
R29  55.88,17.14 0 top
R30  32.64,64.52 270 top
R31  68.58,29.21 90 top
R32  68.58,5.08 270 top
R33  72.39,29.21 90 top
R34  69.85,5.08 270 top
R35  72.39,5.08 270 top
R36  78.74,5.08 270 top
R37  76.2,29.21 90 top
R38  34.92,25.78 0 top
R39  68.58,53.98 180 top
U1  13.97,20.32 180 top
U2  26.04,20.32 90 top
U3  41.27,17.14 90 top
U4  70.48,60.96 180 top
U5  27.94,69.85 180 top
U6  25.4,64.52 270 top

### Tracks (layer width: path | path; a pad name or v marks a point on that pad's centre or on a via)
+3V3  (via drill 0.4)
  Top 0.254: 33.55,70.17 C16.1 | R26.2 64.14,31.75 | R31.2 68.58,31.75 | U3.4 42.55,15.95 | 42.55,15.95 43.12,15.95 43.43,16.26 44.41,16.26 | 32.38,1.65 33.15,0.89 43.56,0.89 47.2,4.53 C21.1 | R9.1 33.4,21.59 34.04,20.95 34.04,18.41 33.4,17.78 R22.1 32.38,17.57 v32.38,9.4 | v32.38,6.99 32.38,1.65 | 32.38,1.65 23.11,1.65 22.23,2.54 R20.1 | C22.1 70.7,66.46 69.85,67.31 67.94,67.31 66.04,65.41 63.92,65.41 | U3.5 42.48,16.02 42.55,15.95 | v71.75,31.75 71.75,30.7 R33.2
  Top 0.305: U5.5 33.55,70.17 | C16.1 C17.1 | v58.67,5.71 59.44,5.71 61.34,3.81 67.18,3.81 67.6,4.23 R32.2 R34.2 R35.2 73.45,4.23 R3.2
  Top 0.406: U4.2 71.12,65.37 C22.1 | J5.2 v53.34,66.67 | C17.1 36.36,70.06 36.83,69.6 J6.4 | 85.47,30.52 C14.1 | 44.41,16.26 C11.1 | v51.65,68.36 52.24,68.36 52.83,68.96 52.83,69.76 C25.1 53.98,70.91 J3.3
  Top 0.61: v54.48,5.71 54.48,1.73 CON2.4 | A1.2 86.36,27.05 85.51,27.9 C13.1 C14.1 | v50.16,31.75 64.14,31.75 68.58,31.75 v71.75,31.75 | v84.58,31.75 85.09,31.75 85.47,31.37 85.47,30.52 | v53.34,6.86 47.33,6.86 C21.1 C20.1 47.2,15.66 46.35,16.51 | R30.2 32.64,62.23
  Top 0.813: v50.16,37.08 26.92,37.08 v15.24,48.77 | J5.2 53.34,61.85 | 53.34,61.85 58.67,61.85 59.18,62.36 C24.+ 61.34,62.36 63.92,64.94 63.92,65.41 C23.1 62.87,68.11 J1.3 | 53.34,61.85 39.75,61.85 39.37,62.23 36.83,62.23 | 36.83,62.23 32.64,62.23 21.59,62.23 20.95,62.87 C28.1 17.36,61.17 15.66,59.48 C27.1 15.24,57.37 J2.3 | v50.16,31.75 50.16,27.94 46.35,24.13 C12.+ 46.35,16.51 46.35,16.38 44.54,16.38 C11.1 | 36.83,62.23 J6.4
  Bottom 0.254: v32.38,9.4 v32.38,6.99
  Bottom 0.305: v54.48,5.71 v58.67,5.71
  Bottom 0.406: v53.34,66.67 v51.65,68.36
  Bottom 0.61: v71.75,31.75 v84.58,31.75 | v53.34,6.86 v54.48,5.71
  Bottom 0.813: v50.16,31.75 v50.16,37.08 | v15.24,48.77 J2.3
  pour Top (no thermals): 42.04,16.26 42.04,15.75 44.45,15.75 44.45,16.26
+5V  (via drill 0.4)
  Top 0.203: R5.1 26.2,16.09 27.05,15.24 27.05,11.68 26.8,11.43 v24.38,11.43
  Top 0.254: U2.4 26.54,16.59 R5.1 | 19.27,12.28 20.11,11.43 v21.72,11.43 R19.2 | R1.2 5.8,14.82 6.99,16 6.99,19.3 7.62,19.94 v9.91,19.94 | v12.32,19.94 12.83,19.94 13.21,19.56 13.21,18.16 12.95,17.91 12.95,16.7 U1.20
  Top 0.305: C5.1 C4.1 12.99,14.78 U1.20 | U2.18 23.24,20.32 23.11,20.19 23.11,20.07 23.11,19.94 23.24,19.81 24.03,19.81 U2.19 | C6.1 22.44,19.9
  Top 0.406: C5.1 15,12.7 L1.2 | 22.01,19.68 C6.1
  Top 0.61: L1.2 16.33,12.28 C2.1 19.27,12.28 20.32,13.34 20.32,19.05 20.95,19.68 22.01,19.68 | 22.44,19.9 22.61,20.07 23.11,20.07
  Bottom 0.254: v24.38,11.43 v21.72,11.43 | v9.91,19.94 v12.32,19.94
CAM_CSN  (via drill 0.4)
  Top 0.254: A1.12 73.67,27.17 73.41,27.43 73.41,31.37 58.8,45.97 45.47,45.97 40.01,51.44 v27.94,51.44
  Bottom 0.254: v27.94,51.44 J2.8
DTR_N  (via drill 0.4)
  Top 0.203: v57.78,29.84 57.78,23.5 | 57.78,23.5 55.88,21.59 55.88,15.24 R27.1 56.41,14.29 Q4.E | Q3.E 58.87,20 59.69,20.83 59.69,22.99 59.18,23.5 57.78,23.5 | U1.2 17.55,25.16 20.95,28.57 20.95,32.64 21.46,33.15 v57.78,33.15
  Bottom 0.203: v57.78,33.15 v57.78,29.84
GND  (via drill 0.4)
  Top 0.203: v79.88,18.54 79.86,18.54 A1.39
  Top 0.254: R15.2 18.67,71.08 v18.67,69.85 18.67,68.62 R16.2 | U5.8 32.02,72.12 v32.38,71.75 32.1,71.47 U5.7 | U3.10 40.52,19.32 v40.77,19.56 41.02,19.3 U3.9 | U3.2 v41.02,14.86 | v20.95,2.41 19.68,2.41 R21.2 | v44.45,75.06 C26.2 | R13.2 28.96,39.37 v27.94,38.35
  Top 0.305: U1.18 11.7,14.83 C4.2 | U1.21 13.64,17.71 v14.35,18.41 | U1.26 v16.89,18.41 16.25,17.77 U1.25 | U1.7 14.29,25.94 C3.2 | U2.3 26.04,19.3 v26.54,19.81 | U2.11 27.04,21.32 | U2.10 27.04,21.32 | 27.04,21.32 v26.54,20.83
  Top 0.406: CON1.GND 14,5.68 v13.97,5.71 13.97,6.77 C1.2 | D1.2 v6.73,8.89 | v11.56,11.43 11.56,12.61 C5.2 C4.2 | R2.1 v7.62,11.81 | C3.2 v13.08,26.04 | v50.93,10.92 50.93,12.3 CON2.G3 | v56.9,11.05 56.9,12.3 CON2.G4 | v52.2,3.05 52.2,1.69 CON2.6 | v60.07,3.17 60.07,1.9 CON2.G1 | v48.9,3.68 48.9,2.06 CON2.G2 | 87.25,30.52 C14.2 | v9.91,28.57 R25.1 | C16.2 C17.2 | 35.6,68.33 C17.2 | J2.4 17.78,57.37 C27.2 | BAT2.- v78.74,60.96 | U4.5 v68.58,56.52 68.58,55.5 69.43,54.65 R39.1 | C22.2 v67.69,65.79 65.67,63.76 C24.- | A1.38 v87.64,9.77 v87.63,9.78 | v31.11,63.75 29.93,63.75 C18.2 C19.2 27.84,63.57 U6.2 | v69.85,24.51 A1.15 | v52.58,28.19 52.58,29.54 PB2.1 | v67.31,30.73 66.29,30.73 66.04,30.48 66.08,30.1 C15.2 | PB2.2 60.45,29.54 v60.45,28.19 | v35.56,66.93 C17.2 | U5.4 29.15,69.53 v28.83,69.85 | v14.22,62.23 14.86,62.87 C28.2 | C2.2 v18.41,8.89 | C6.2 v22.23,16.89 | C8.2 v24.13,13.08 | R23.2 v33.15,19.68 | R8.2 29.84,26.8 v28.96,27.69 27.94,26.67 R7.2 | R6.2 v26.04,27.69 | R4.2 v26.04,9.4 | R12.2 27.94,9.78 v27.56,9.4 | C10.2 44.07,20.28 v44.07,19.18 44.45,18.8 C11.2 | R18.2 v37.85,31.75 | Q5.2 37.78,19.62 v37.08,18.92 38.1,17.91 C9.2 | C25.2 51.22,69.76 v49.53,68.07
  Top 0.61: A1.1 87.64,27.43 87.21,27.85 C13.2 C14.2 | v87.25,31.88 87.25,30.52 | C7.2 v24.13,27.69 | 17.53,1.52 19.68,1.52 19.68,2.41 | C20.2 45.09,8.89 v44.2,8 45.21,6.99 C21.2 | C12.- v46.35,31.88 | 7.75,1.52 7.11,1.52 v6.35,0.76
  Top 0.813: C23.2 65.62,69.64 J1.4
  other vias: 26.04,5.33 46.35,2.41 16.76,52.2 62.1,2.67 79.5,0.89 87.76,0.89 87.76,6.6 23.11,52.2 19.94,52.2 16.76,49.66 26.04,50.55 19.56,46.74 22.35,44.07 25.15,41.15 28.7,47.88 31.37,45.21 30.61,9.4 37.47,38.23 42.42,38.23 47.12,38.23 51.69,38.23 55.37,36.45 59.94,36.45 63.5,35.31 68.83,33.4 63.75,39.12 60.96,42.04 58.29,44.83 54.1,44.83 49.66,44.83 45.21,44.83 40.77,44.83 36.32,44.83 0.76,0.76 0.76,7.37 0.76,13.84 0.76,19.94 0.76,26.29 0.76,33.27 0.76,39.5 0.76,45.59 0.76,51.18 0.76,57.28 0.76,63.5 0.76,69.98 0.76,75.44 7.87,74.68 10.54,75.44 14.86,75.44 18.92,75.44 23.24,75.44 27.69,75.44 32.26,75.44 36.7,75.44 41.15,75.44 51.44,74.93 56.64,74.93 61.47,74.93 66.17,74.93 70.74,74.93 76.2,74.93 81.66,74.93 87.88,74.93 88.01,69.98 88.01,51.44 84.84,51.44 88.14,46.99 88.14,42.67 88.14,38.48 88.14,34.54 13.59,52.2 9.78,52.2 14.86,47.37 9.91,47.37 6.1,49.78 6.22,53.59 6.22,61.34 6.99,64.64 10.29,65.53 16.26,40.51 12.06,40.51 18.16,30.35 4.95,40.51 3.68,35.18 4.57,30.23 10.54,72.26 15.62,72.26 13.46,65.53 8.89,60.07 17.91,58.93 21.59,63.88 28.83,66.8 13.97,57.78 24.13,60.96 32.38,60.96 49.53,59.05 57.02,59.05 67.94,50.16 74.17,54.86 74.55,43.81 50.04,16.13 53.47,22.61 56.52,27.3 8,24.13 87.63,20.83 87.63,24.51 79.38,11.05 74.3,21.84 69.85,16.13 73.66,11.05 83.82,10.41 69.85,19.94 66.67,19.94 61.59,23.37 65.41,10.41 61.34,18.29 69.22,11.94 33.27,47.24 37.85,47.37 33.27,50.55 45.34,50.93 48.64,48.26 42.55,47.37 37.85,50.55 38.1,66.04 41.91,71.12 46.48,68.07 25.53,20.83 25.53,19.81 5.08,44.32 15.24,43.69 20.32,35.94 21.59,58.04 30.1,58.04 37.08,55.5 31.37,55.37 33.4,30.73 30.23,12.45 20.7,21.34 3.94,20.57 20.95,27.05 22.86,23.24 39.88,26.04 26.42,31.75 33.66,12.06 16,14.35 87.63,13.46 87.63,17.27 37.85,14.61 44.96,12.7 48.9,19.81 39.5,10.16 59.18,66.8 64.26,60.45 66.67,68.45 76.96,2.79 76.33,6.6 74.68,4.83 44.45,30.61 44.45,26.04
  pour Bottom (isolate 0.254): 0,0 0,76.2 88.9,76.2 88.9,0
  pour Top (isolate 0.254, rank 2, no thermals): 0,0 88.9,0 88.9,76.2 0,76.2
H_SCK
  Top 0.254: A1.31 R36.1
HSPI_MISO  (via drill 0.4)
  Top 0.254: v79.38,52.07 75.06,56.39 75.06,67.94 74.8,68.2 74.55,68.2 74.3,67.94 74.3,67.06 74.04,66.8 73.79,66.8 73.53,67.06 73.53,67.69 73.28,67.94 72.39,67.94 J1.6 | A1.5 82.56,29.33 81.92,29.97 81.92,37.21 82.42,37.72 82.42,38.1 82.17,38.35 80.14,38.35 79.88,38.61 79.88,38.99 80.14,39.24 81.92,39.24 82.17,39.5 82.17,39.88 81.92,40.13 78.74,40.13 77.47,41.27 77.47,42.67 76.71,43.43 76.71,43.69 76.96,43.94 81.03,43.94 81.28,44.2 81.28,44.45 81.03,44.7 76.96,44.7 76.71,44.96 76.71,45.21 76.96,45.47 80.01,45.47 80.26,45.72 80.26,45.97 80.01,46.23 76.96,46.23 76.71,46.48 76.71,46.74 76.96,46.99 77.22,46.99 77.47,47.24 77.47,47.5 77.22,47.75 76.83,47.75 76.58,48.01 76.58,48.26 76.83,48.51 77.22,48.51 77.47,48.77 v77.47,50.16
  Bottom 0.254: v77.47,50.16 v79.38,52.07
HSPI_SCK  (via drill 0.4)
  Top 0.254: J1.5 67.94,68.58 68.58,67.94 70.87,67.94 73.91,64.9 73.91,56.26 v75.95,54.23 | R36.2 79.16,4.23 v81.28,6.35 | v81.92,13.34 82.55,13.97 82.55,21.59 v81.28,22.86 | v75.95,51.44 75.95,41.53 81.28,36.2 81.28,29.46 v81.92,28.83
  Bottom 0.254: v81.28,6.35 81.28,12.7 v81.92,13.34 | v75.95,51.44 v75.95,54.23 | v81.92,28.83 81.92,25.4 81.28,24.77 v81.28,22.86
IO0  (via drill 0.4)
  Top 0.254: v68.71,14.61 71.11,12.21 71.11,8.35 A1.25 | Q3.C 62.36,20.95 v66.17,17.14
  Bottom 0.254: v68.71,14.61 v66.17,17.14
IO2_MMC_D0  (via drill 0.4)
  Top 0.203: v65.15,4.7 67.18,4.7 67.56,5.08 69.22,5.08 69.47,5.33 69.47,5.55 R34.1 A1.24 | v51.82,4.7 51.18,4.06 51.18,1.74 CON2.7
  Top 0.254: A1.24 69.86,8.88 66.67,12.06 v66.17,12.06 | Q4.C 62.99,15.24 v63.63,14.61
  Bottom 0.203: v65.15,4.7 64.39,4.7 64.14,4.95 64.14,6.73 63.88,6.99 63.63,6.99 63.37,6.73 63.37,4.95 63.12,4.7 62.87,4.7 62.61,4.95 62.61,6.73 62.36,6.99 62.1,6.99 61.85,6.73 61.85,4.95 61.59,4.7 61.34,4.7 61.09,4.95 61.09,6.73 60.83,6.99 60.58,6.99 60.33,6.73 60.33,4.95 60.07,4.7 v51.82,4.7
  Bottom 0.254: v66.17,12.06 v63.63,14.61
LCD_CSN  (via drill 0.4)
  Top 0.254: A1.30 77.47,15.23 76.83,15.88 76.83,20.95 v80.01,24.13 | v81.03,27.94 81.03,28.57 80.64,28.96 80.64,34.16 60.33,54.48 J4.3
  Bottom 0.254: v80.01,24.13 80.01,26.92 v81.03,27.94
LCD_DC
  Top 0.254: A1.8 78.75,32.13 58.8,52.07 56.52,52.07 55.24,53.34 J4.5
LEP_CSN  (via drill 0.4)
  Top 0.254: A1.33 81.28,9.53 83.82,12.06 83.82,21.59 82.8,22.61 v82.8,24.13 | v81.53,51.05 76.2,56.39 76.2,67.94 75.56,68.58 J1.8 | v78.74,48.26 83.06,43.94 83.06,37.34 82.55,36.83 82.55,30.48 v82.8,30.23
  Bottom 0.254: v78.74,48.26 v81.53,51.05 | v82.8,30.23 v82.8,24.13
MMC_CLK  (via drill 0.4)
  Top 0.203: v61.85,9.53 72.39,20.07 A1.13 R33.1 | v57.28,9.53 53.34,5.59 53.34,1.7 CON2.5
  Bottom 0.203: v57.28,9.53 v61.85,9.53
MMC_CMD  (via drill 0.4)
  Top 0.203: A1.23 R32.1 68.49,5.84 67.44,5.84 67.31,5.97 67.31,6.73 67.06,6.99 66.8,6.99 66.55,6.73 66.55,5.71 66.29,5.46 66.04,5.46 65.79,5.71 65.79,6.73 65.53,6.99 65.28,6.99 65.02,6.73 65.02,5.71 64.77,5.46 64.52,5.46 64.26,5.71 64.26,6.73 64.01,6.99 63.75,6.99 63.5,6.73 63.5,5.71 63.25,5.46 62.99,5.46 62.74,5.71 62.74,8.51 62.48,8.76 62.23,8.76 61.98,8.51 61.98,5.71 61.72,5.46 61.47,5.46 61.21,5.71 61.21,6.35 60.96,6.6 59.18,6.6 v58.67,7.11 | v55.88,6.86 55.88,5.97 55.63,5.71 55.37,5.71 55.12,5.46 55.12,5.21 55.37,4.95 55.75,4.95 56.01,4.7 56.01,4.45 55.75,4.19 55.37,4.19 55.12,3.94 55.12,3.68 55.37,3.43 55.75,3.43 56.01,3.17 56.01,2.92 55.75,2.67 55.5,2.67 55.37,2.54 55.37,1.81 CON2.3 55.5,1.69
  Bottom 0.203: v58.67,7.11 57.4,7.11 57.15,6.86 v55.88,6.86
MMC_D1  (via drill 0.4)
  Top 0.203: v65.53,2.54 75.18,2.54 76.07,3.43 76.07,4.83 75.06,5.84 72.48,5.84 R35.1 A1.26 | v50.16,3.81 50.16,1.77 CON2.8
  Bottom 0.203: v50.16,3.81 64.26,3.81 v65.53,2.54
MMC_D2
  Top 0.203: CON2.1 57.72,8.06 58.42,8.76 60.58,8.76 60.83,9.02 60.83,9.27 60.58,9.53 59.44,9.53 59.18,9.78 59.18,10.16 59.44,10.41 61.98,10.41 71.12,19.56 A1.14
MMC_D3
  Top 0.203: CON2.2 56.62,7.72 58.42,9.53 58.42,12.95 58.67,13.21 58.93,13.21 59.18,12.95 59.18,12.57 59.44,12.32 59.69,12.32 59.94,12.57 59.94,12.95 60.2,13.21 60.45,13.21 60.71,12.95 60.71,12.57 60.96,12.32 61.21,12.32 61.47,12.57 61.47,13.08 61.72,13.34 64.14,13.34 68.58,17.78 A1.16 R31.1
N$1  (via drill 0.4)
  Top 0.406: CON1.VBUS 11.4,4.73 | 13.12,8.89 C1.1
  Top 0.508: 11.4,4.73 v10.92,5.21
  Top 0.61: v11.68,7.24 11.68,8.89 | 11.68,8.89 D1.5 | 11.68,8.89 13.12,8.89 | C1.1 15.21,9.11 L1.1
  Bottom 0.61: v10.92,5.21 10.92,6.48 v11.68,7.24
N$2
  Top 0.203: CON1.D+ 12.7,5.71 12.06,6.35 7.37,6.35 6.6,7.11 6.6,7.62 6.86,7.87 8.31,7.87 D1.3
N$3
  Top 0.203: CON1.D- 12.05,5.6 11.68,5.97 7.24,5.97 6.1,7.11 6.1,9.27 6.6,9.78 8.31,9.78 D1.1
N$4
  Top 0.305: U1.17 11.04,20.06 11.81,20.83 15.62,20.83 16.26,21.46 16.26,23.96 U1.4 16.25,25.88 C3.1
N$5  (via drill 0.4)
  Top 0.203: U1.1 18.2,22.13 17.78,21.72 v17.14,21.72 | v15.24,21.72 6.48,21.72 D2.C
  Bottom 0.203: v17.14,21.72 v15.24,21.72
N$6
  Top 0.203: D1.6 10.29,16.56 U1.16
N$7
  Top 0.203: D1.4 9.46,7.94 9.27,8.13 9.27,10.41 9.78,10.92 9.78,16.63 U1.15
N$8
  Top 0.406: C18.1 C19.1 27.84,65.47 U6.1 | R30.1 C18.1 | U5.1 30.84,67.16 29.84,66.17 C18.1
N$9
  Top 0.254: U2.2 25.54,17.66 25.15,17.27 25.15,14.73 25.4,14.48 25.95,14.48 R5.2 R4.1
N$10
  Top 0.254: U2.13 R6.1
N$11  (via drill 0.4)
  Top 0.406: R39.2 66.67,53.98 J4.1
  Top 0.813: J4.1 65.41,57.15 62.23,60.33 v34.92,60.33 | Q6.3 v34.92,31.75 | v34.92,38.86 v34.92,49.53
  Bottom 0.813: v34.92,31.75 v34.92,38.86 | v34.92,49.53 v34.92,60.33
N$12  (via drill 0.4)
  Top 0.254: v12.32,18.54 12.32,16.69 U1.19 | v9.91,18.54 8,18.54 7.62,18.16 R2.2 6.95,14.82 6.73,14.61 6.73,13.34 6.52,13.12 R1.1
  Bottom 0.254: v9.91,18.54 v12.32,18.54
N$13  (via drill 0.4)
  Top 0.254: BAT2.+2 80.9,54.36 v79.38,55.88 | v69.85,55.88 U4.6
  Bottom 0.254: v79.38,55.88 v69.85,55.88
N$14
  Top 0.254: Q2.C 50.97,23.46 PB2.3
N$15
  Top 0.254: U2.12 26.54,23.14 R7.1 R8.1
N$17
  Top 0.254: Q6.1 33.98,25.88 R38.1 34.29,25.57 34.29,22.86 35.09,22.05 Q5.3
N$18
  Top 0.254: U2.9 28.57,20.82 29.34,21.59 R9.2
N$19  (via drill 0.4)
  Top 0.254: R10.2 17.14,28.57 v17.78,27.94 | U2.17 23,20.82 19.94,23.88 v19.94,25.78
  Bottom 0.254: v17.78,27.94 v19.94,25.78
N$20
  Top 0.254: U2.5 27.04,17 R11.1
N$21
  Top 0.254: U3.1 40.52,15.76 40.01,15.24 40.01,12.72 L2.1
  pour Top (no thermals): 40.51,16 39.5,16 39.5,13.21 40.26,13.21 40.26,15.24 40.51,15.49
N$22
  Top 0.254: R14.2 Q1.3
N$23
  Top 0.254: 24.44,5.29 D4.P$1 24.13,5.8 24.13,6.99 23.33,7.79 R19.1
N$24
  Top 0.203: R27.2 53.76,17.42 Q2.B
N$25
  Top 0.254: R24.2 9.53,26.67 10.39,25.8 U1.13
N$26
  Top 0.203: Q3.B 57.47,21.91 57.15,21.59 57.15,19.47 R28.2
N$27
  Top 0.203: Q4.B 57.69,16.19 R29.2
N$28  (via drill 0.4)
  Top 0.254: R12.1 R11.2 28.16,14.61 v30.23,14.61 | v33.66,14.61 34.67,15.62 34.67,21.46 32.13,24 v32.13,31.75 | R13.1 30.99,39.37 v32.13,38.23
  Bottom 0.254: v33.66,14.61 v30.23,14.61 | v32.13,38.23 v32.13,31.75
N$29
  Top 0.254: U3.3 41.52,15.5 42.55,14.48
  pour Top (no thermals): 41.66,15.49 41.53,15.49 42.04,14.86 42.04,13.59 43.05,13.59 43.05,14.1
N$32
  Top 0.254: U3.7 42.09,18.34 42.16,18.41
  Top 0.406: 42.16,18.41 42.16,20.15 C10.1
PWR_EN  (via drill 0.4)
  Top 0.254: U3.11 39.11,17.39 38.73,17.02 36.58,17.02 35.18,15.62 v35.18,12.06 | PB1.2 38.1,5.42 v38.1,12.06 | U3.11 39.88,17.39 39.88,17.4 | D3.C 41.05,23.91 R17.1 37.85,21.34 | 37.85,21.34 37.47,20.95 36.88,20.95 Q5.1 | 37.85,21.34 38.23,20.95 39.37,20.95 39.88,20.45 39.88,17.59 U3.11
  Bottom 0.254: v35.18,12.06 v38.1,12.06
PWR_HOLD  (via drill 0.4)
  Top 0.254: R16.1 16.61,68.9 Q1.1 14.78,68.71 v12.06,68.71 | v47.62,50.93 50.16,48.39 v51.44,48.39 58.93,48.39 75.18,32.13 75.18,27.43 74.94,27.18 A1.11 | v47.62,59.05 20.32,59.05 19.05,57.78 19.05,53.98 18.41,53.34 8.26,53.34 6.99,54.61 6.99,60.07 v12.06,65.15 | D3.A v41.27,31.75 | v41.27,35.94 51.44,35.94 52.7,37.21 52.7,42.55 v51.44,43.81
  Bottom 0.254: v12.06,65.15 v12.06,68.71 | v41.27,31.75 v41.27,35.94 | v51.44,43.81 v51.44,48.39 | v47.62,50.93 J4.8 v47.62,59.05
RST_N  (via drill 0.4)
  Top 0.254: v60.33,57.4 63.5,57.4 64.14,56.77 64.14,52.07 v80.64,35.56 | A1.3 85.09,26.92 84.45,27.56 84.45,30.48 83.82,31.11 83.82,33.15 84.2,33.53 v84.2,35.56 | C15.1 R26.1 | v67.44,35.56 66.04,34.16 v62.36,34.16 | 64.1,28.32 R26.1 | R26.1 63.97,28.19 62.99,28.19 v62.36,27.56 60.52,25.72 PB2.4
  Bottom 0.254: v84.2,35.56 v80.64,35.56 v67.44,35.56 | v62.36,34.16 v62.36,27.56 | v60.33,57.4 59.94,57.4 J4.4
RTS_N  (via drill 0.4)
  Top 0.203: v55.24,29.84 55.24,22.1 53.85,20.7 53.85,20.04 Q2.E 53.48,19.05 R28.1 R29.1 | U1.3 16.89,25.15 19.68,27.94 19.68,33.02 20.7,34.04 v55.24,34.04
  Bottom 0.203: v55.24,34.04 v55.24,29.84
RXD  (via drill 0.4)
  Top 0.203: U1.5 15.6,22.96 15.37,22.73 4.06,22.73 2.92,21.59 v2.92,9.02 | A1.35 83.83,6.99 77.47,0.64 64.77,0.64 64.39,1.02 v63.5,1.02
  Bottom 0.203: v63.5,1.02 10.92,1.02 v2.92,9.02
SCL  (via drill 0.4)
  Top 0.254: A1.37 v86.36,24.12 | v87,33.66 87,43.18 76.83,53.34 74.3,53.34 72.39,55.24 U4.8 72.39,60.33 v71.12,61.59 | v61.59,67.94 61.59,71.12 60.96,71.75 58.42,71.75 57.78,71.12 J1.1 56.13,69.85 54.99,68.71 53.47,68.71 51.82,67.06 50.55,67.06 J5.4 48.26,68.58 46.99,69.85 v43.81,69.85 | 32.13,68.96 v32.38,69.22 32.05,68.88 U5.3 27.22,68.88 26.67,68.33 26.67,67.06 26.42,66.8 23.37,66.8 21.97,65.41 14.73,65.41 10.16,60.83 J2.1
  Top 0.305: v86.36,24.12 v86.36,24.13
  Bottom 0.254: v86.36,24.13 86.36,33.02 v87,33.66 | v71.12,61.59 67.94,61.59 v61.59,67.94 | v43.81,69.85 33.02,69.85 v32.38,69.22
SDA  (via drill 0.4)
  Top 0.254: v70.48,60.33 71.12,59.69 U4.7 71.12,55.24 73.66,52.7 76.2,52.7 85.85,43.05 v85.85,34.92 | J1.2 58.55,68.07 53.72,68.07 50.8,65.15 J5.3 50.8,63.5 50.16,62.87 47.62,62.87 46.35,64.14 46.35,66.67 45.09,67.94 v41.91,67.94 | v32.38,67.94 32.1,68.22 U5.2 27.59,68.22 27.3,67.94 27.3,66.67 26.92,66.29 23.75,66.29 22.35,64.9 15.62,64.9 12.7,61.98 J2.2 | v85.09,22.86 A1.36
  Bottom 0.254: v70.48,60.33 67.94,60.33 60.33,67.94 J1.2 | v32.38,67.94 v41.91,67.94 | v85.09,22.86 85.09,24.77 85.85,25.53 v85.85,34.92
SLEEP_N
  Top 0.254: U1.12 11.04,28.19 11.43,28.57 R10.1
SNS_AUX1
  Top 0.254: J6.3 39.37,71.12 37.47,73.03 25.94,73.03 U5.9
SNS_AUX2
  Top 0.254: U5.10 23.9,71.47 23.62,71.75 23.62,73.03 24.26,73.66 38.1,73.66 40.64,71.12 40.64,66.04 J6.2
SNS_BATT
  Top 0.254: Q1.2 16.61,70.8 R15.1 17.14,71.33 17.14,71.75 17.78,72.39 19.05,72.39 22.57,68.88 U5.14
SNS_BTN  (via drill 0.4)
  Top 0.254: R17.2 R18.1 39.37,29.25 v39.37,31.75 | U5.16 23.12,67.58 21.97,66.42 7.11,66.42 5.08,64.39 5.08,48.26 6.99,46.35 15.88,46.35 26.29,35.94 v39.37,35.94
  Bottom 0.254: v39.37,31.75 v39.37,35.94
SNS_PWREN
  Top 0.254: R24.1 R25.2 3.81,28.57 2.54,29.84 2.54,65.79 10.16,73.41 19.56,73.41 23.44,69.53 U5.13
SNS_STAT1
  Top 0.254: U5.12 23.68,70.17 19.56,74.3 10.16,74.3 1.65,65.79 1.65,8.51 2.41,7.75 4.7,7.75 7.49,4.95 7.49,3.3 7.75,3.05 17.78,3.05 18.29,3.56 18.29,4.7 18.88,5.29 R21.1 R20.2 23.03,5.29 23.24,4.95 23.24,3.81 23.87,3.18 D5.A
SNS_STAT2  (via drill 0.4)
  Top 0.254: U5.15 22.5,68.22 21.59,67.31 6.99,67.31 4.45,64.77 4.45,46.99 6.35,45.09 15.75,45.09 25.91,34.92 v29.84,34.92 | R23.1 R22.2 | 30.13,19.82 R23.1 | U2.7 28.69,19.82 v29.08,19.43 30.01,19.43 R23.1 | v29.08,22.86 30.73,22.86 31.37,23.5 31.37,27.18 29.84,28.7 v29.84,31.75
  Bottom 0.254: v29.08,19.43 v29.08,22.86 | v29.84,31.75 v29.84,34.92
SNS_T
  Top 0.254: U5.11 23.79,70.83 22.86,71.75 22.86,73.66 23.5,74.3 40.01,74.3 42.12,72.17 C26.1 45.51,72.17 47.62,74.3 49.53,74.3 J3.2
STAT1  (via drill 0.4)
  Top 0.203: U2.8 28.96,20.32 29.34,20.7 30.86,20.7 31.11,20.45 31.11,11.56 v28.96,9.4 | D4.P$2 27.61,5.46 28.07,5.46 28.96,6.35 v28.96,6.99 D5.C
  Bottom 0.203: v28.96,9.4 v28.96,6.99
TS_CSN  (via drill 0.4)
  Top 0.254: A1.29 76.2,22.35 v74.3,24.26 | v74.3,29.21 74.3,31.75 58.8,47.24 46.1,47.24 v42.55,50.8
  Bottom 0.254: v74.3,24.26 v74.3,29.21 | v42.55,50.8 J4.10
TS_IRQ  (via drill 0.4)
  Top 0.254: A1.7 80.02,26.92 79.38,27.56 79.38,32.77 58.42,53.72 57.02,53.72 56.52,54.23 v56.52,56.9 | v55.37,58.04 v40.01,58.04
  Bottom 0.254: v56.52,56.9 v55.37,58.04 | v40.01,58.04 J4.11
TXD  (via drill 0.4)
  Top 0.203: A1.34 82.56,6.48 77.6,1.52 74.46,1.52 R3.1 74.13,1.52 64.52,1.52 v63.5,2.54 | v3.81,9.91 3.81,16.51 4.45,17.14 D2.A
  Bottom 0.203: v63.5,2.54 62.36,1.4 12.32,1.4 v3.81,9.91
V+  (via drill 0.4)
  Top 0.203: U3.6 41.52,17.39 41.02,16.89 U3.12
  Top 0.254: U3.12 40.08,16.83 40.01,16.76
  Top 0.305: U2.20 24.04,18.29 24.13,18.32 U2.1 | 24.04,16.18 C8.1
  Top 0.406: PB1.1 35.85,4.48 36.2,4.83 36.2,8.26
  Top 0.508: 40.01,16.76 39.37,16.76 38.77,16.17 C9.1
  Top 0.813: 24.04,18.29 24.04,16.18 | C8.1 23.71,16.09 22.86,15.24 22.86,9.53 24.13,8.26 36.2,8.26 v36.2,15.24 37.12,16.17 C9.1 | v35.81,24.26 35.77,24.3 R38.2 35.88,25.88 Q6.2
  Bottom 0.813: v35.81,24.26 35.81,18.03 36.2,17.65 v36.2,15.24
V_SCK
  Top 0.254: A1.10 R37.1
VBATT  (via drill 0.4)
  Top 0.254: 7.62,69.85 R14.1 | 25.04,23 25.15,23.11
  Top 0.305: BAT1.+ 4.45,41.91 3.17,43.18 3.17,65.41 7.62,69.85 | U2.16 24.04,23.11 | U2.14 25.54,22.98 25.4,23.11 | U2.15 25.04,23
  Top 0.61: 25.4,23.11 25.15,23.11 24.04,23.11
  Top 0.813: BAT1.+ 17.14,41.91 22.23,36.83 v22.23,35.31 | 24.04,23.11 24.04,24.45 C7.1 23.07,24.55 22.23,25.4 v22.23,31.75
  Bottom 0.813: v22.23,35.31 v22.23,31.75
VSPI_MISO
  Top 0.254: A1.6 81.28,26.92 81.15,27.05 80.9,27.05 80.01,27.94 80.01,33.4 59.05,54.36 59.05,56.26 57.66,57.66 56.13,57.66 55.24,56.77 46.61,56.77 J4.9 43.31,57.02 24.32,57.02 J2.6
VSPI_MOSI  (via drill 0.4)
  Top 0.254: A1.9 77.47,32.13 58.42,51.18 56.13,51.18 55.88,51.44 55.88,51.94 55.63,52.2 55.24,52.2 54.99,51.94 54.99,51.44 54.74,51.18 54.36,51.18 54.1,51.44 54.1,53.34 53.85,53.59 53.47,53.59 53.21,53.34 53.21,52.58 52.96,52.32 52.7,52.32 52.45,52.58 52.45,53.72 52.7,53.98 J4.6 50.04,52.58 v25.4,52.58
  Bottom 0.254: v25.4,52.58 J2.7
VSPI_SCK  (via drill 0.4)
  Top 0.254: R37.2 76.2,32.26 59.05,49.4 58.55,49.4 58.29,49.66 58.29,50.29 58.04,50.55 57.66,50.55 57.4,50.29 57.4,49.15 57.15,48.9 56.77,48.9 56.52,49.15 56.52,50.29 56.26,50.55 55.88,50.55 55.63,50.29 55.63,49.15 55.37,48.9 54.99,48.9 54.74,49.15 54.74,50.29 54.48,50.55 54.1,50.55 53.85,50.29 53.85,49.15 53.59,48.9 53.21,48.9 52.96,49.15 52.96,50.42 52.45,50.93 v50.16,50.93 | J2.5 22.29,53.59 48.51,53.59 J4.7
  Bottom 0.254: v50.16,50.93 J4.7
VSYNC  (via drill 0.4)
  Top 0.254: A1.4 83.83,30.35 83.19,30.99 83.19,36.32 83.82,36.96 v83.82,44.07 | v86.87,47.12 77.22,56.77 77.22,65.79 78.11,66.67 J1.9
  Bottom 0.254: v83.82,44.07 v86.87,47.12

### Text on the board
tPlace: TMP | + | Lepton | 1 | 3V3 | A0 | A1 | GND | SCL | SDA | 3V3 | GND | ArduCAM | Analog | I2C | CR 1220 / CR 1225 | 1 | 1 | LCD | Do NOT insert backwards! | - | + | Rev 3 | (c) 2019-2020 danjuliodesigns, LLC | RST | FireCAM | PWR BTN | CHG